# Altium project LAUNCHXL-F28069_B_1400922.PrjPcb
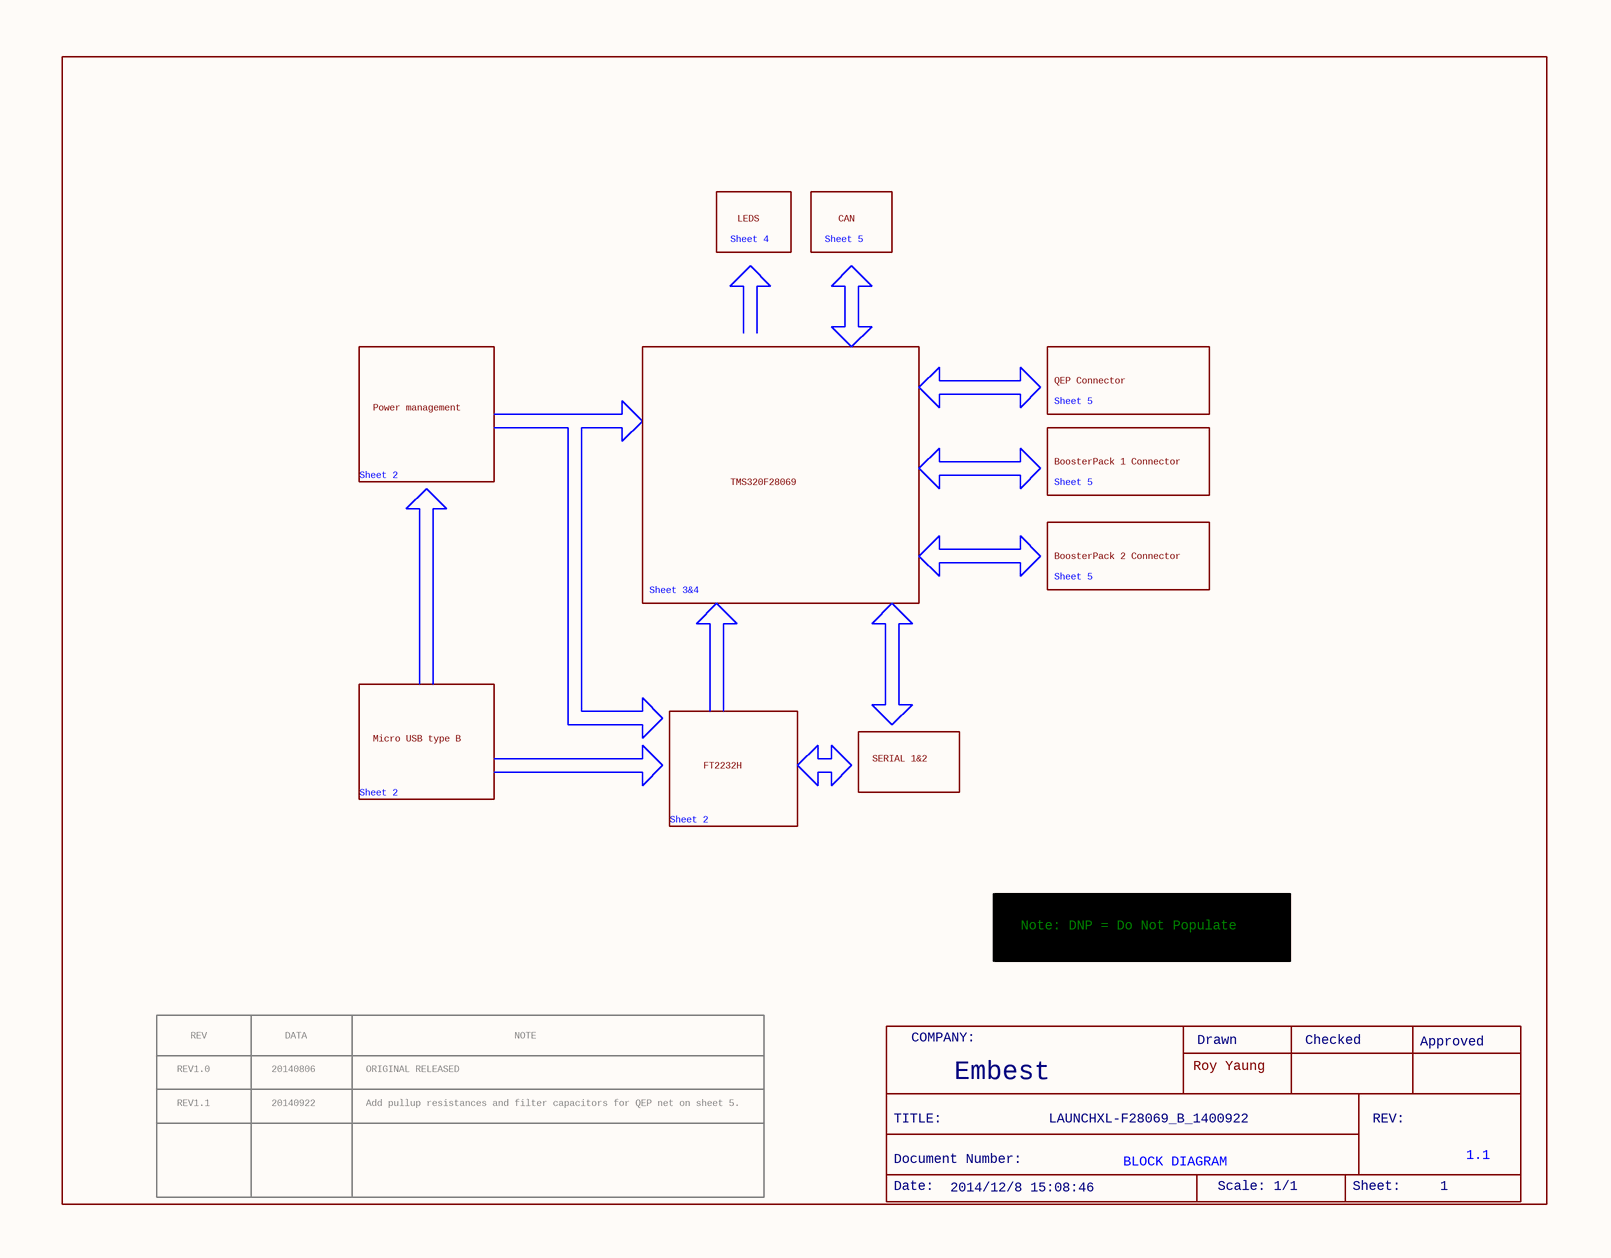
[diagram p0: LAUNCHXL-F28069_B_1400922_0.SchDoc]
7 sheets, 199 parts. Net scope: global (net labels, ports and power ports of the same name join across sheets).
Sheets:
  LAUNCHXL-F28069_B_1400922_0.SchDoc
  LAUNCHXL-F28069_B_1400922_1.SchDoc
  LAUNCHXL-F28069_B_1400922_2.SchDoc
  LAUNCHXL-F28069_B_1400922_3.SchDoc
  LAUNCHXL-F28069_B_1400922_4.SchDoc
  LAUNCHXL-F28069_B_1400922_5.SchDoc
  LAUNCHXL-F28069_B_1400922_6.SchDoc

## Sheet LAUNCHXL-F28069_B_1400922_0.SchDoc: LAUNCHXL-F28069_B_1400922
size 301 x 234 mm; Origin: Eagle; Date: 2014/12/8 15:08:46; SheetNumber: 1; GateName_1: G$1; SymbolName_1: FRAME_A_L; LibraryName: frames; DeviceSetName: FRAME_A_L; GateName_2: G$2; SymbolName_2: DOCFIELD; Sheet: Sheet:; REV: REV:; COMPANY: COMPANY:; Scale:1/1: Scale: 1/1; Drawn: Drawn; Checked: Checked; Approved: Approved; Embest: Embest

### Notes on the sheet
- Sheet 4
- LEDS
- Sheet 5
- CAN
- QEP Connector
- Power management
- BoosterPack 1 Connector
- Sheet 2
- TMS320F28069
- Sheet 3&4
- BoosterPack 2 Connector
- Micro USB type B
- FT2232H
- SERIAL 1&2
- Note: DNP = Do Not Populate
- REV1.0
- REV
- 20140806
- DATA
- ORIGINAL RELEASED
- NOTE
- COMPANY:
- Roy Yaung
- Drawn
- Checked
- Approved
- REV1.1
- 20140922
- Add pullup resistances and filter capacitors for QEP net on sheet 5.
- TITLE:
- Embest
- LAUNCHXL-F28069_B_1400922
- REV:
- Date:
- Document Number:
- 2014/12/8 15:08:46
- BLOCK DIAGRAM
- Scale: 1/1
- Sheet:
- 1
- 1.1

## Sheet LAUNCHXL-F28069_B_1400922_1.SchDoc: LAUNCHXL-F28069_B_1400922
size 302 x 238 mm; Origin: Eagle; Date: 2014/12/8 15:08:46; SheetNumber: 2; GateName_1: G$1; SymbolName_1: FRAME_A_L; LibraryName: frames; DeviceSetName: FRAME_A_L; GateName_2: G$2; SymbolName_2: DOCFIELD; Sheet: Sheet:; REV: REV:; COMPANY: COMPANY:; Scale:1/1: Scale: 1/1; Drawn: Drawn; Checked: Checked; Approved: Approved; Embest: Embest
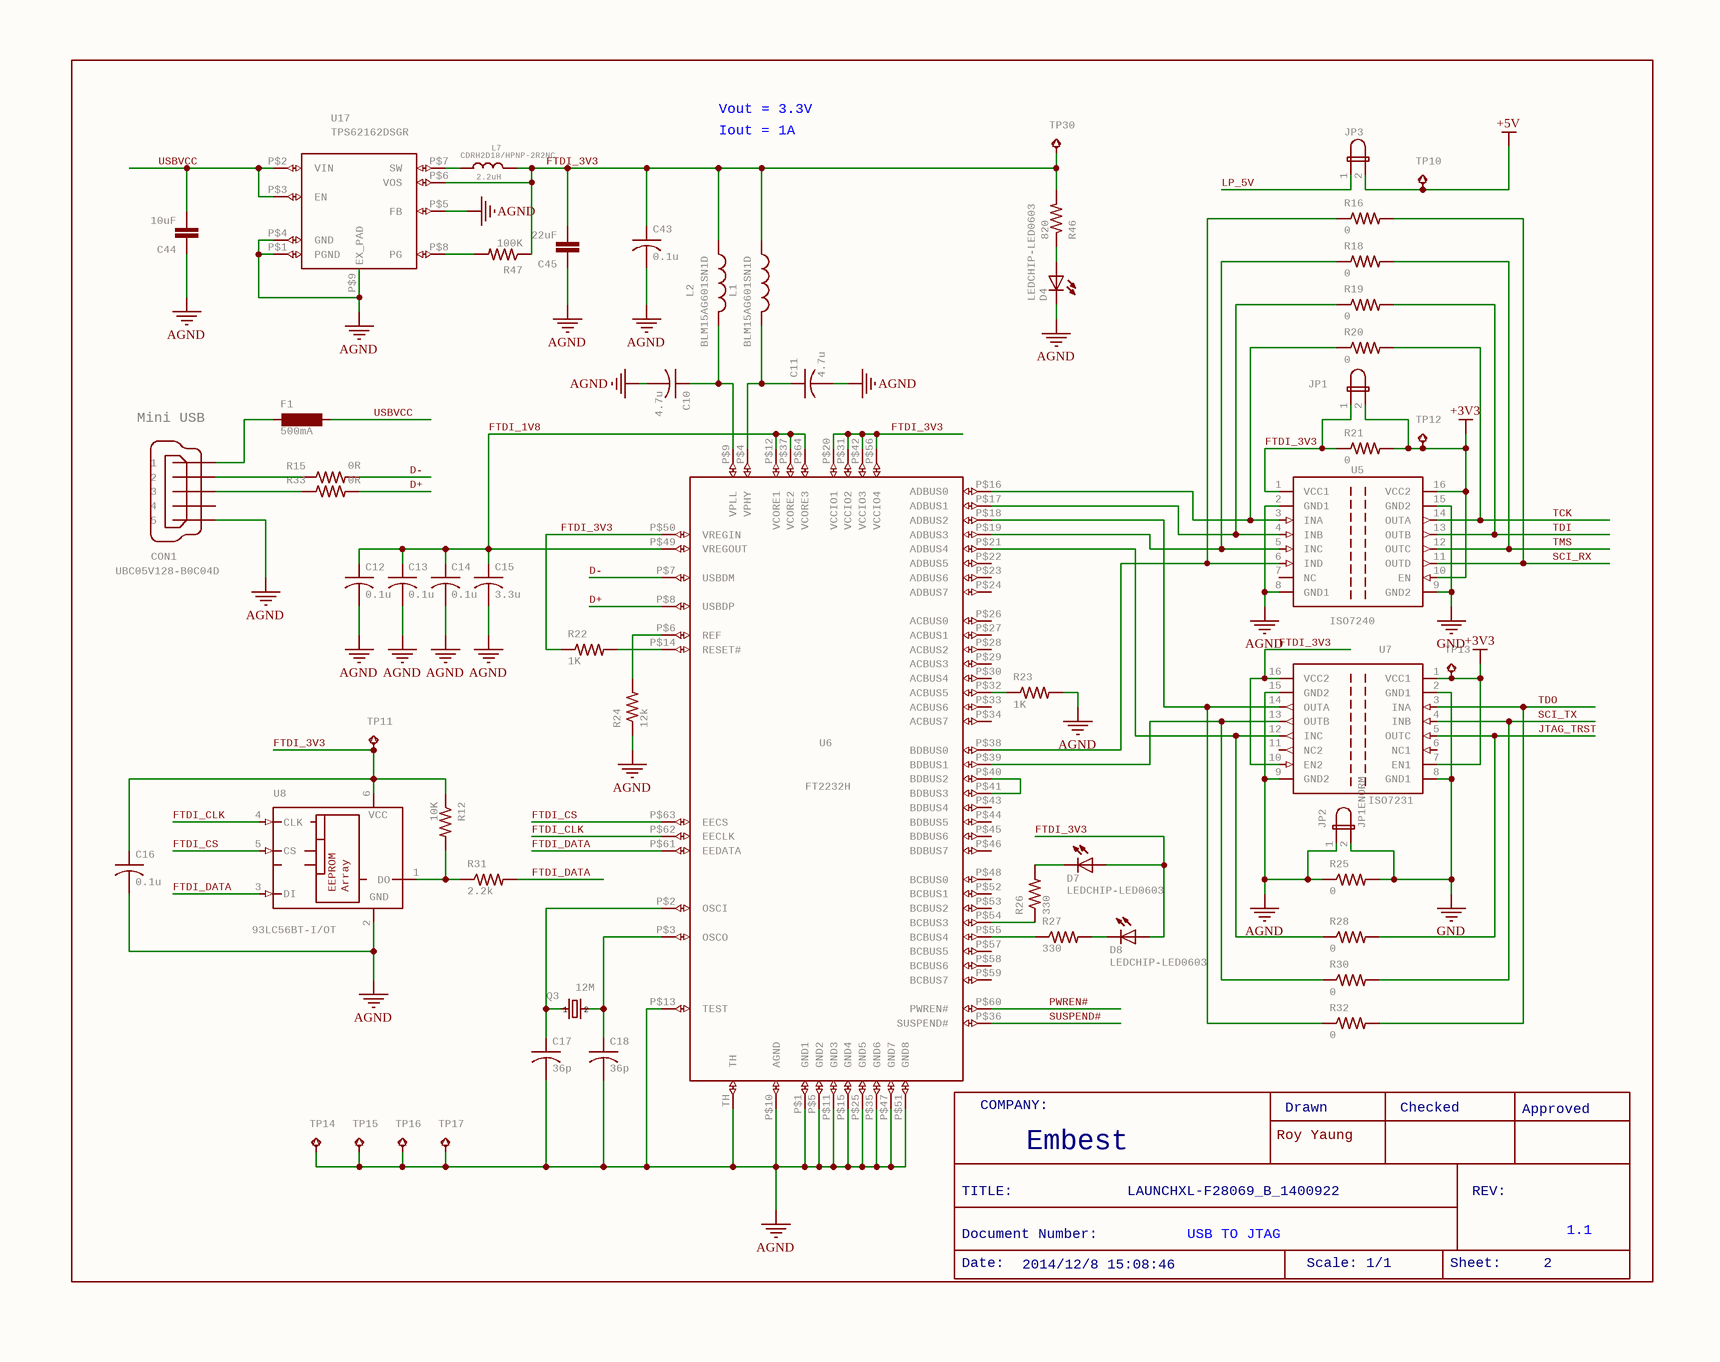
[diagram p1: LAUNCHXL-F28069_B_1400922_1.SchDoc]

### Parts
C10  4.7u  [C0402]
C11  4.7u  [C0402]
C12  0.1u  [C0402]
C13  0.1u  [C0402]
C14  0.1u  [C0402]
C15  3.3u  [C0402]
C16  0.1u  [C0402]
C17  36p  [C0402]
C18  36p  [C0402]
C43  0.1u  [C0402]
C44  10uF  [SPARKFUN_1210]
C45  22uF  [SPARKFUN_1210]
CON1  UBC05V128-B0C04D  [32005-201]
D4  LEDCHIP-LED0603  [CHIP-LED0603]
D7  LEDCHIP-LED0603  [CHIP-LED0603]
D8  LEDCHIP-LED0603  [CHIP-LED0603]
F1  500mA  [L1812]
JP1  JP1ENORM  [JP1]  (value not drawn)
JP2  JP1ENORM  [JP1]
JP3  JP1ENORM  [JP1]  (value not drawn)
L1  BLM15AG601SN1D  [R0402]
L2  BLM15AG601SN1D  [R0402]
L7  2.2uH  [INDUCT-3.2*3.2]
Q3  12M  [HC49UP]
R12  10K  [R0402]
R15  0R  [R0402]
R16  0  [R1206]
R18  0  [R1206]
R19  0  [R1206]
R20  0  [R1206]
R21  0  [R1206]
R22  1K  [R0402]
R23  1K  [R0402]
R24  12k  [R0402]
R25  0  [R1206]
R26  330  [R0402]
R27  330  [R0402]
R28  0  [R1206]
R30  0  [R1206]
R31  2.2k  [R0402]
R32  0  [R1206]
R33  0R  [R0402]
R46  820  [R0402]
R47  100K  [R0402]
TP10  TESTPAD_TPB1,27  [TESTPAD_B1,27]  (value not drawn)
TP11  TESTPAD_TPB1,27  [TESTPAD_B1,27]  (value not drawn)
TP12  TESTPAD_TPB1,27  [TESTPAD_B1,27]  (value not drawn)
TP13  TESTPAD_TPB1,27  [TESTPAD_B1,27]  (value not drawn)
TP14  TESTPAD_TPB1,27  [TESTPAD_B1,27]  (value not drawn)
TP15  TESTPAD_TPB1,27  [TESTPAD_B1,27]  (value not drawn)
TP16  TESTPAD_TPB1,27  [TESTPAD_B1,27]  (value not drawn)
TP17  TESTPAD_TPB1,27  [TESTPAD_B1,27]  (value not drawn)
TP30  TESTPAD_TPB1,27  [TESTPAD_B1,27]  (value not drawn)
U5  ISO7240  [SO-16DW]
U6  FT2232H  [QFN64]
U7  ISO7231  [SO-16DW]
U8  93LC56BT-I/OT  [SOT23-6]
U17  TPS62162DSGR  [TI_DSG8]
U$9  ROY_JUMPER  [ROY_JUMPER]  (value not drawn)
U$10  ROY_JUMPER  [ROY_JUMPER]  (value not drawn)
U$11  ROY_JUMPER  [ROY_JUMPER]  (value not drawn)

### Nets
+3V3: JP1.2 R21.2 TP12.TP TP13.TP U5.10(EN) U5.16(VCC2) U7.1(VCC1) U7.7(EN1)
+5V: JP3.2 TP10.TP  [project net EQEP1A]
AGND: C10.2 C11.2 C12.2 C13.2 C14.2 C15.2 C16.2 C17.2 C18.2 C43.2 C44.1 C45.1 CON1.5 D4.C JP2.1 R23.2 R24.1 R25.1 TP14.TP TP15.TP TP16.TP TP17.TP U5.2(GND1) U5.8(GND1) U6.P$1(GND1) U6.P$5(GND2) U6.P$10(AGND) U6.P$11(GND3) U6.P$13(TEST) U6.P$15(GND4) U6.P$25(GND5) U6.P$35(GND6) U6.P$47(GND7) U6.P$51(GND8) U6.TH U7.9(GND2) U7.15(GND2) U8.2(GND) U17.P$1(PGND) U17.P$4(GND) U17.P$5(FB) U17.P$9(EX_PAD)
GND: JP2.2 R25.2 U5.9(GND2) U5.15(GND2) U7.2(GND1) U7.8(GND1)
D+: R33.2 U6.P$8(USBDP)
D-: R15.2 U6.P$7(USBDM)
FTDI_1V8: C12.1 C13.1 C14.1 C15.1 U6.P$12(VCORE1) U6.P$37(VCORE2) U6.P$49(VREGOUT) U6.P$64(VCORE3)
FTDI_3V3: C16.1 C43.1 C45.2 D7.A D8.A JP1.1 L1.1 L2.1 L7.P$1 R12.1 R21.1 R22.1 R46.2 R47.1 TP11.TP TP30.TP U5.1(VCC1) U6.P$20(VCCIO1) U6.P$31(VCCIO2) U6.P$42(VCCIO3) U6.P$50(VREGIN) U6.P$56(VCCIO4) U7.10(EN2) U7.16(VCC2) U8.6(VCC) U17.P$6(VOS)
FTDI_CLK: U6.P$62(EECLK) U8.4(CLK)
FTDI_CS: U6.P$63(EECS) U8.5(CS)
FTDI_DATA: R31.2 U6.P$61(EEDATA) U8.3(DI)
JTAG_TRST: R28.2 U7.5(OUTC)
LP_5V: JP3.1
PWREN#: U6.P$60(PWREN#)
SCI_RX: R16.2 U5.11(OUTD)
SCI_TX: R30.2 U7.4(INB)
SUSPEND#: U6.P$36(SUSPEND#)
TCK: R20.2 U5.14(OUTA)
TDI: R19.2 U5.13(OUTB)
TDO: R32.2 U7.3(INA)
TMS: R18.2 U5.12(OUTC)
USBVCC: C44.2 F1.1 U17.P$2(VIN) U17.P$3(EN)
NetC10_1: C10.1 L2.2 U6.P$9(VPLL)
NetC11_1: C11.1 L1.2 U6.P$4(VPHY)
NetC17_1: C17.1 Q3.1 U6.P$2(OSCI)
NetC18_1: C18.1 Q3.2 U6.P$3(OSCO)
NetCON1_1: CON1.1 F1.2
NetCON1_2: CON1.2 R15.1
NetCON1_3: CON1.3 R33.1
NetD4_A: D4.A R46.1
NetD7_C: D7.C R26.2
NetD8_C: D8.C R27.2
NetL7_P$2: L7.P$2 U17.P$7(SW)
NetR12_2: R12.2 R31.1 U8.1(DO)
NetR16_1: R16.1 U5.6(IND) U6.P$38(BDBUS0)
NetR18_1: R18.1 U5.5(INC) U6.P$19(ADBUS3)
NetR19_1: R19.1 U5.4(INB) U6.P$17(ADBUS1)
NetR20_1: R20.1 U5.3(INA) U6.P$16(ADBUS0)
NetR22_2: R22.2 U6.P$14(RESET#)
NetR23_1: R23.1 U6.P$32(ACBUS5)
NetR24_2: R24.2 U6.P$6(REF)
NetR26_1: R26.1 U6.P$54(BCBUS3)
NetR27_1: R27.1 U6.P$55(BCBUS4)
NetR28_1: R28.1 U6.P$21(ADBUS4) U7.12(INC)
NetR30_1: R30.1 U6.P$39(BDBUS1) U7.13(OUTB)
NetR32_1: R32.1 U6.P$18(ADBUS2) U7.14(OUTA)
NetR47_2: R47.2 U17.P$8(PG)
NetU6_P$40: U6.P$40(BDBUS2) U6.P$41(BDBUS3)

Not connected (* = marked no-connect by the designer): CON1 4; U5 7(NC); U6 P$22(ADBUS5) P$23(ADBUS6) P$24(ADBUS7) P$26(ACBUS0) P$27(ACBUS1) P$28(ACBUS2) P$29(ACBUS3) P$30(ACBUS4) P$33(ACBUS6) P$34(ACBUS7) P$43(BDBUS4) P$44(BDBUS5) P$45(BDBUS6) P$46(BDBUS7) P$48(BCBUS0) P$52(BCBUS1) P$53(BCBUS2) P$57(BCBUS5) P$58(BCBUS6) P$59(BCBUS7); U7 6(NC1) 11(NC2)

### Notes on the sheet
- (near L7) CDRH2D18/HPNP-2R2NC
- Vout = 3.3V
- Iout = 1A
- (near CON1) Mini USB
- (near U6) COMPANY:
- Embest
- Roy Yaung
- Drawn
- Checked
- Approved
- TITLE:
- Document Number:
- LAUNCHXL-F28069_B_1400922
- USB TO JTAG
- REV:
- 1.1
- Date:
- 2014/12/8 15:08:46
- Scale: 1/1
- Sheet:
- 2

### Library data of the parts
C10-C18 C43 = C-USC0402: CAPACITOR, American symbol; GateName_1: G$1; SymbolName_1: C-US; DeviceName: C0402; LibraryName: rcl; DeviceSetName: C-US
C44 C45 = SPARKFUN_CAP1210: CapacitorStandard 0603 ceramic capacitor, and 0.1" leaded capacitor.; GateName_1: G$1; DeviceName: 1210; SymbolName_1: SPARKFUN_CAP; LibraryName: RF430FRL152H_EVM_a; DeviceSetName: SPARKFUN_CAP
CON1 = MINI-USB-32005-201: MINI USB-B Conector   Source: www.cypressindustries.com; GateName_1: G$1; SymbolName_1: MINI-USB-5; DeviceName: 32005-201; LibraryName: con-cypressindustries; DeviceSetName: MINI-USB-; MF: MF; MPN: MPN; OC_FARNELL: unknown; OC_NEWARK: unknown
D4 D7 D8 = LEDCHIP-LED0603: LED   OSRAM: - CHIPLED LG R971, LG N971, LY N971, LG Q971, LY Q971, LO R971, LY R971 LH N974, LH R974 LS Q976, LO Q976, LY Q976 LO Q996 - Hyper CHIPLED LW Q18S LB Q993, LB Q99A, LB R99A - SideLED LS A670, LO A670, LY A670, LG A670, LP A670 LB A673, LV A673, LT A673, LW A673 LH A674 LY A675 LS A676, LA A676, LO A676, LY A676, LW A676 LS A679, LY A679, LG A679 -  Hyper Micro SIDELED庐 LS Y876, LA Y876, LO Y876, LY Y876 LT Y87S - SmartLED LW L88C, LW L88S LB L89C, LB L89S, LG L890 LS L89K, LO L89K, LY L89K LS L896, LA L896, LO L896, LY L896 - TOPLED LS T670, LO T670, LY T670, LG T670, LP T670 LSG T670, LSP T670, LSY T670, LOP T670, LYG T670 LG T671, LOG T671, LSG T671 LB T673, LV T673, LT T673, LW T673 LH T674 LS T676, LA T676, LO T676, LY T676, LB T676, LH T676, LSB T676, LW T676 LB T67C, LV T67C, LT T67C, LS T67K, LO T67K, LY T67K, LW E67C LS E67B, LA E67B, LO E67B, LY E67B, LB E67C, LV E67C, LT E67C LW T67C LS T679, LY T679, LG T679 LS T770, LO T770, LY T770, LG T770, LP T770 LB T773, LV T773, LT T773, LW T773 LH T774 LS E675, LA E675, LY E675, LS T675 LS T776, LA T776, LO T776, LY T776, LB T776 LHGB T686 LT T68C, LB T68C - Hyper Mini TOPLED庐 LB M676 - Mini TOPLED Santana庐 LG M470 LS M47K, LO M47K, LY M47K    Source: http://www.osram.convergy.de   LUXEON: - LUMILED庐 LXK2-PW12-R00, LXK2-PW12-S00, LXK2-PW14-U00, LXK2-PW14-V00 LXK2-PM12-R00, LXK2-PM12-S00, LXK2-PM14-U00 LXK2-PE12-Q00, LXK2-PE12-R00, LXK2-PE12-S00, LXK2-PE14-T00, LXK2-PE14-U00 LXK2-PB12-K00, LXK2-PB12-L00, LXK2-PB12-M00, LXK2-PB14-N00, LXK2-PB14-P00, LXK2-PB14-Q00 LXK2-PR12-L00, LXK2-PR12-M00, LXK2-PR14-Q00, LXK2-PR14-R00 LXK2-PD12-Q00, LXK2-PD12-R00, LXK2-PD12-S00 LXK2-PH12-R00, LXK2-PH12-S00 LXK2-PL12-P00, LXK2-PL12-Q00, LXK2-PL12-R00    Source: www.luxeon.com   KINGBRIGHT:   KA-3528ASYC Source: www.kingbright.com; GateName_1: G$1; SymbolName_1: LED; DeviceName: CHIP-LED0603; LibraryName: led; DeviceSetName: LED
F1 = L-EUL1812: INDUCTOR, European symbol; GateName_1: G$1; SymbolName_1: L-EU; DeviceName: L1812; LibraryName: rcl; DeviceSetName: L-EU
JP1-JP3 = JP1ENORM: JUMPER; GateName_1: A; SymbolName_1: JP2E; DeviceName: NORM; DeviceSetName: JP1E; LibraryName: jumper
L1 L2 = L-US0402: INDUCTOR, American symbol; GateName_1: G$1; SymbolName_1: L-US; DeviceName: 0402; LibraryName: rcl; DeviceSetName: L-US
L7 = VLF4012A`: GateName_1: 1; SymbolName_1: INDUCTOR; DeviceName: `; LibraryName: LAUNCHXL-F28027; DeviceSetName: VLF4012A
Q3 = CRYSTALHC49UP: CRYSTAL; GateName_1: G$1; SymbolName_1: Q; DeviceName: HC49UP; LibraryName: crystal; DeviceSetName: CRYSTAL; 1: 1; 2: 2; MF: MF; MPN: MPN; OC_FARNELL: unknown; OC_NEWARK: unknown
R12 R15 R22-R24 R26 R27 R31 R33 R46 R47 = R-US_R0402: RESISTOR, American symbol; GateName_1: G$1; SymbolName_1: R-US; DeviceSetName: R-US_; DeviceName: R0402; LibraryName: rcl
R16 R18-R21 R25 R28 R30 R32 = R-US_R1206: RESISTOR, American symbol; GateName_1: G$1; SymbolName_1: R-US; DeviceSetName: R-US_; DeviceName: R1206; LibraryName: rcl
TP10-TP17 TP30 = TESTPAD_TPB1,27: Test pad; GateName_1: G$1; DeviceName: B1,27; SymbolName_1: TESTPAD_TP; LibraryName: RF430FRL152H_EVM_a; DeviceSetName: TESTPAD_TP
U5 = ISO7240: HIGH SPEED QUAD DIGITAL ISOLATORS   Source: http://focus.ti.com/lit/ds/symlink/iso7240m.pdf; MPN: ISO7240MDW; GateName_1: G$1; SymbolName_1: ISO7240; LibraryName: texas; DeviceSetName: ISO7240; MF: MF; OC_FARNELL: 1755124; OC_NEWARK: 58M0385
U6 = FT2232H: GateName_1: G$1; SymbolName_1: FT2232H; LibraryName: ti_trey; DeviceSetName: FT2232H
U7 = ISO7231: GateName_1: G$1; SymbolName_1: ISO7231; LibraryName: texas; DeviceSetName: ISO7231
U8 = 93*: Serial EPROM   1 K/2 K/4 K, low voltage, Microwire; GateName_1: G$1; SymbolName_1: 93LC46; LibraryName: ti_trey; DeviceSetName: 93*; Array: Array; VCC: VCC; GND: GND; EEPROM: EEPROM
U17 = TPS62162DSGR: GateName_1: G$1; SymbolName_1: TPS62162; LibraryName: LAUNCHXL-F28027; DeviceSetName: TPS62162DSGR
U$9-U$11 = ROY_JUMPER: GateName_1: G$1; SymbolName_1: ROY_JUMPER; LibraryName: roy; DeviceSetName: ROY_JUMPER

## Sheet LAUNCHXL-F28069_B_1400922_2.SchDoc: LAUNCHXL-F28069_B_1400922
size 301 x 234 mm; Origin: Eagle; Date: 2014/12/8 15:08:46; SheetNumber: 3; GateName_1: G$1; SymbolName_1: FRAME_A_L; LibraryName: frames; DeviceSetName: FRAME_A_L; GateName_2: G$2; SymbolName_2: DOCFIELD; Sheet: Sheet:; REV: REV:; COMPANY: COMPANY:; Scale:1/1: Scale: 1/1; Drawn: Drawn; Checked: Checked; Approved: Approved; Embest: Embest
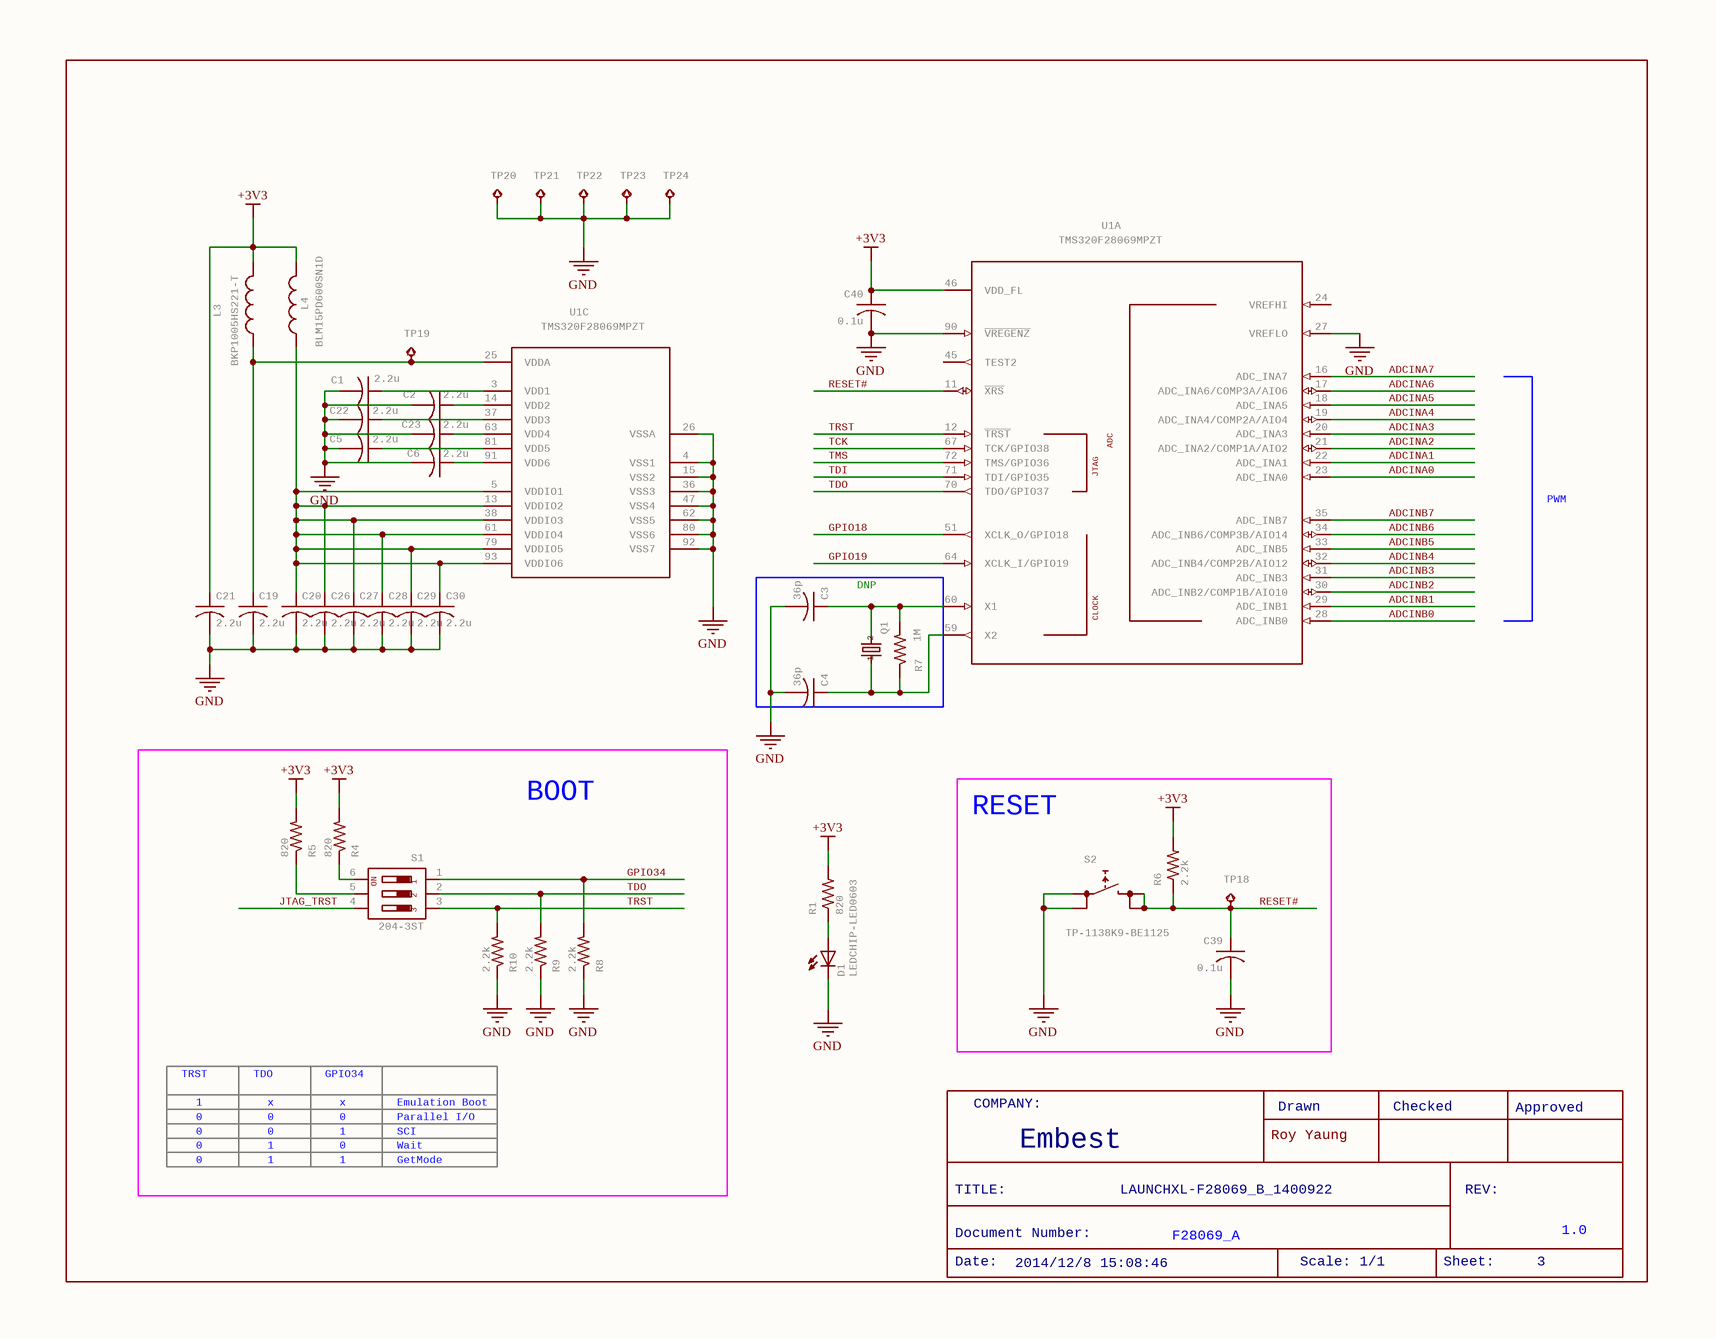
[diagram p2: LAUNCHXL-F28069_B_1400922_2.SchDoc]

### Parts
C1  2.2u  [C0402]
C2  2.2u  [C0402]
C3  36p  [C0402]
C4  36p  [C0402]
C5  2.2u  [C0402]
C6  2.2u  [C0402]
C19  2.2u  [C0402]
C20  2.2u  [C0402]
C21  2.2u  [C0402]
C22  2.2u  [C0402]
C23  2.2u  [C0402]
C26  2.2u  [C0402]
C27  2.2u  [C0402]
C28  2.2u  [C0402]
C29  2.2u  [C0402]
C30  2.2u  [C0402]
C39  0.1u  [C0402]
C40  0.1u  [C0402]
D1  LEDCHIP-LED0603  [CHIP-LED0603]
L3  BKP1005HS221-T  [R0402]
L4  BLM15PD600SN1D  [R0402]
Q1  CRYSTALHC49S  [HC49/S]  (value not drawn)
R1  820  [R0402]
R4  820  [R0402]
R5  820  [R0402]
R6  2.2k  [R0402]
R7  1M  [R0402]
R8  2.2k  [R0402]
R9  2.2k  [R0402]
R10  2.2k  [R0402]
S1  204-3ST  [CTS-219-03]
S2  TP-1138K9-BE1125  [FSMJSMA]
TP18  TESTPAD_TPB1,27  [TESTPAD_B1,27]  (value not drawn)
TP19  TESTPAD_TPB1,27  [TESTPAD_B1,27]  (value not drawn)
TP20  TESTPAD_TPB1,27  [TESTPAD_B1,27]  (value not drawn)
TP21  TESTPAD_TPB1,27  [TESTPAD_B1,27]  (value not drawn)
TP22  TESTPAD_TPB1,27  [TESTPAD_B1,27]  (value not drawn)
TP23  TESTPAD_TPB1,27  [TESTPAD_B1,27]  (value not drawn)
TP24  TESTPAD_TPB1,27  [TESTPAD_B1,27]  (value not drawn)
U1  TMS320F28069MPZT  [PQFP100]  (parts A,C of 3)

### Blocks framed on the sheet
DNP: C3 C4 Q1 R7
BOOT: R4 R5 R8-R10 S1
RESET: C39 R6 S2 TP18

### Nets
+3V3: C21.1 C40.1 L3.2 L4.2 R1.2 R4.2 R5.2 R6.2 U1.46(VDD_FL)
GND: C1.2 C2.2 C3.2 C4.2 C5.2 C6.2 C19.2 C20.2 C21.2 C22.2 C23.2 C26.2 C27.2 C28.2 C29.2 C30.2 C39.2 C40.2 D1.C R8.1 R9.1 R10.1 S2.P$1 S2.P$2 TP20.TP TP21.TP TP22.TP TP23.TP TP24.TP U1.4(VSS1) U1.15(VSS2) U1.26(VSSA) U1.27(VREFLO) U1.36(VSS3) U1.47(VSS4) U1.62(VSS5) U1.80(VSS6) U1.90(~{VREGENZ}) U1.92(VSS7)
ADCINA0: U1.23(ADC_INA0)
ADCINA1: U1.22(ADC_INA1)
ADCINA2: U1.21(ADC_INA2/COMP1A/AIO2)
ADCINA3: U1.20(ADC_INA3)
ADCINA4: U1.19(ADC_INA4/COMP2A/AIO4)
ADCINA5: U1.18(ADC_INA5)
ADCINA6: U1.17(ADC_INA6/COMP3A/AIO6)
ADCINA7: U1.16(ADC_INA7)
ADCINB0: U1.28(ADC_INB0)
ADCINB1: U1.29(ADC_INB1)
ADCINB2: U1.30(ADC_INB2/COMP1B/AIO10)
ADCINB3: U1.31(ADC_INB3)
ADCINB4: U1.32(ADC_INB4/COMP2B/AIO12)
ADCINB5: U1.33(ADC_INB5)
ADCINB6: U1.34(ADC_INB6/COMP3B/AIO14)
ADCINB7: U1.35(ADC_INB7)
GPIO18: U1.51(XCLK_O/GPIO18)
GPIO19: U1.64(XCLK_I/GPIO19)
GPIO34: R8.2 S1.1
JTAG_TRST: S1.4
RESET#: C39.1 R6.1 S2.P$3 S2.P$4 TP18.TP U1.11(~{XRS})
TCK: U1.67(TCK/GPIO38)
TDI: U1.71(TDI/GPIO35)
TDO: R9.2 S1.2 U1.70(TDO/GPIO37)
TMS: U1.72(TMS/GPIO36)
TRST: R10.2 S1.3 U1.12(~{TRST})
NetC1_1: C1.1 U1.3(VDD1)
NetC2_1: C2.1 U1.14(VDD2)
NetC3_1: C3.1 Q1.2 R7.2 U1.60(X1)
NetC4_1: C4.1 Q1.1 R7.1 U1.59(X2)
NetC5_1: C5.1 U1.81(VDD5)
NetC6_1: C6.1 U1.91(VDD6)
NetC19_1: C19.1 L3.1 TP19.TP U1.25(VDDA)
NetC20_1: C20.1 C26.1 C27.1 C28.1 C29.1 C30.1 L4.1 U1.5(VDDIO1) U1.13(VDDIO2) U1.38(VDDIO3) U1.61(VDDIO4) U1.79(VDDIO5) U1.93(VDDIO6)
NetC22_1: C22.1 U1.37(VDD3)
NetC23_1: C23.1 U1.63(VDD4)
NetD1_A: D1.A R1.1
NetR4_1: R4.1 S1.6
NetR5_1: R5.1 S1.5

Not connected (* = marked no-connect by the designer): U1 24(VREFHI) 45(TEST2)

### Notes on the sheet
- PWM
- TRST
- TDO
- GPIO34
- 1
- 0
- x
- Emulation Boot
- Parallel I/O
- SCI
- Wait
- COMPANY:
- Roy Yaung
- Drawn
- Checked
- Approved
- GetMode
- TITLE:
- Embest
- LAUNCHXL-F28069_B_1400922
- REV:
- Date:
- Document Number:
- 2014/12/8 15:08:46
- F28069_A
- Scale: 1/1
- Sheet:
- 3
- 1.0

### Library data of the parts
C1-C6 C19-C23 C26-C30 C39 C40 = C-USC0402: as C10 on sheet LAUNCHXL-F28069_B_1400922_1; DeviceName: C0402; LibraryName: rcl; DeviceSetName: C-US
D1 = LEDCHIP-LED0603: as D4 on sheet LAUNCHXL-F28069_B_1400922_1; SymbolName_1: LED; DeviceName: CHIP-LED0603; LibraryName: led; DeviceSetName: LED
L3 L4 = L-US0402: as L1 on sheet LAUNCHXL-F28069_B_1400922_1; LibraryName: rcl; DeviceSetName: L-US
Q1 = CRYSTALHC49S: CRYSTAL; GateName_1: G$1; SymbolName_1: Q; DeviceName: HC49S; LibraryName: crystal; DeviceSetName: CRYSTAL; 1: 1; 2: 2; MF: MF; MPN: MPN; OC_FARNELL: 1667008; OC_NEWARK: unknown
R1 R4-R10 = R-US_R0402: as R12 on sheet LAUNCHXL-F28069_B_1400922_1; DeviceName: R0402; LibraryName: rcl
S1 = 219-03*: Surface Mount DIP Switch Series 219 SMT   CTS Electronic Components Sourc: www.ctscorp.com; GateName_1: G$1; SymbolName_1: DIP03; LibraryName: switch-dil; DeviceSetName: 219-03*; 1: 1; 2: 2; 3: 3; ON: ON; MF: MF; MPN: MPN; OC_FARNELL: unknown; OC_NEWARK: unknown
S2 = FSMJSMA: GateName_1: G$1; SymbolName_1: NORMOPEN; LibraryName: switch; DeviceSetName: FSMJSMA
TP18-TP24 = TESTPAD_TPB1,27: as TP10 on sheet LAUNCHXL-F28069_B_1400922_1; SymbolName_1: TESTPAD_TP; LibraryName: RF430FRL152H_EVM_a; DeviceSetName: TESTPAD_TP
U1 = TMS320F28069PZSR: GateName_1: G$1; SymbolName_1: TI_TMSF2806X_FUN; GateName_2: G$2; SymbolName_2: TI_TMSF2806X_IO; GateName_3: G$3; SymbolName_3: TI_TMSF2806X_PW; DeviceName: R; LibraryName: LAUNCHXL-F28027; DeviceSetName: TMS320F28069PZS; JTAG: JTAG; CLOCK: CLOCK; ADC: ADC

## Sheet LAUNCHXL-F28069_B_1400922_3.SchDoc: LAUNCHXL-F28069_B_1400922
size 301 x 234 mm; Origin: Eagle; Date: 2014/12/8 15:08:46; SheetNumber: 4; GateName_1: G$1; SymbolName_1: FRAME_A_L; LibraryName: frames; DeviceSetName: FRAME_A_L; GateName_2: G$2; SymbolName_2: DOCFIELD; Sheet: Sheet:; REV: REV:; COMPANY: COMPANY:; Scale:1/1: Scale: 1/1; Drawn: Drawn; Checked: Checked; Approved: Approved; Embest: Embest
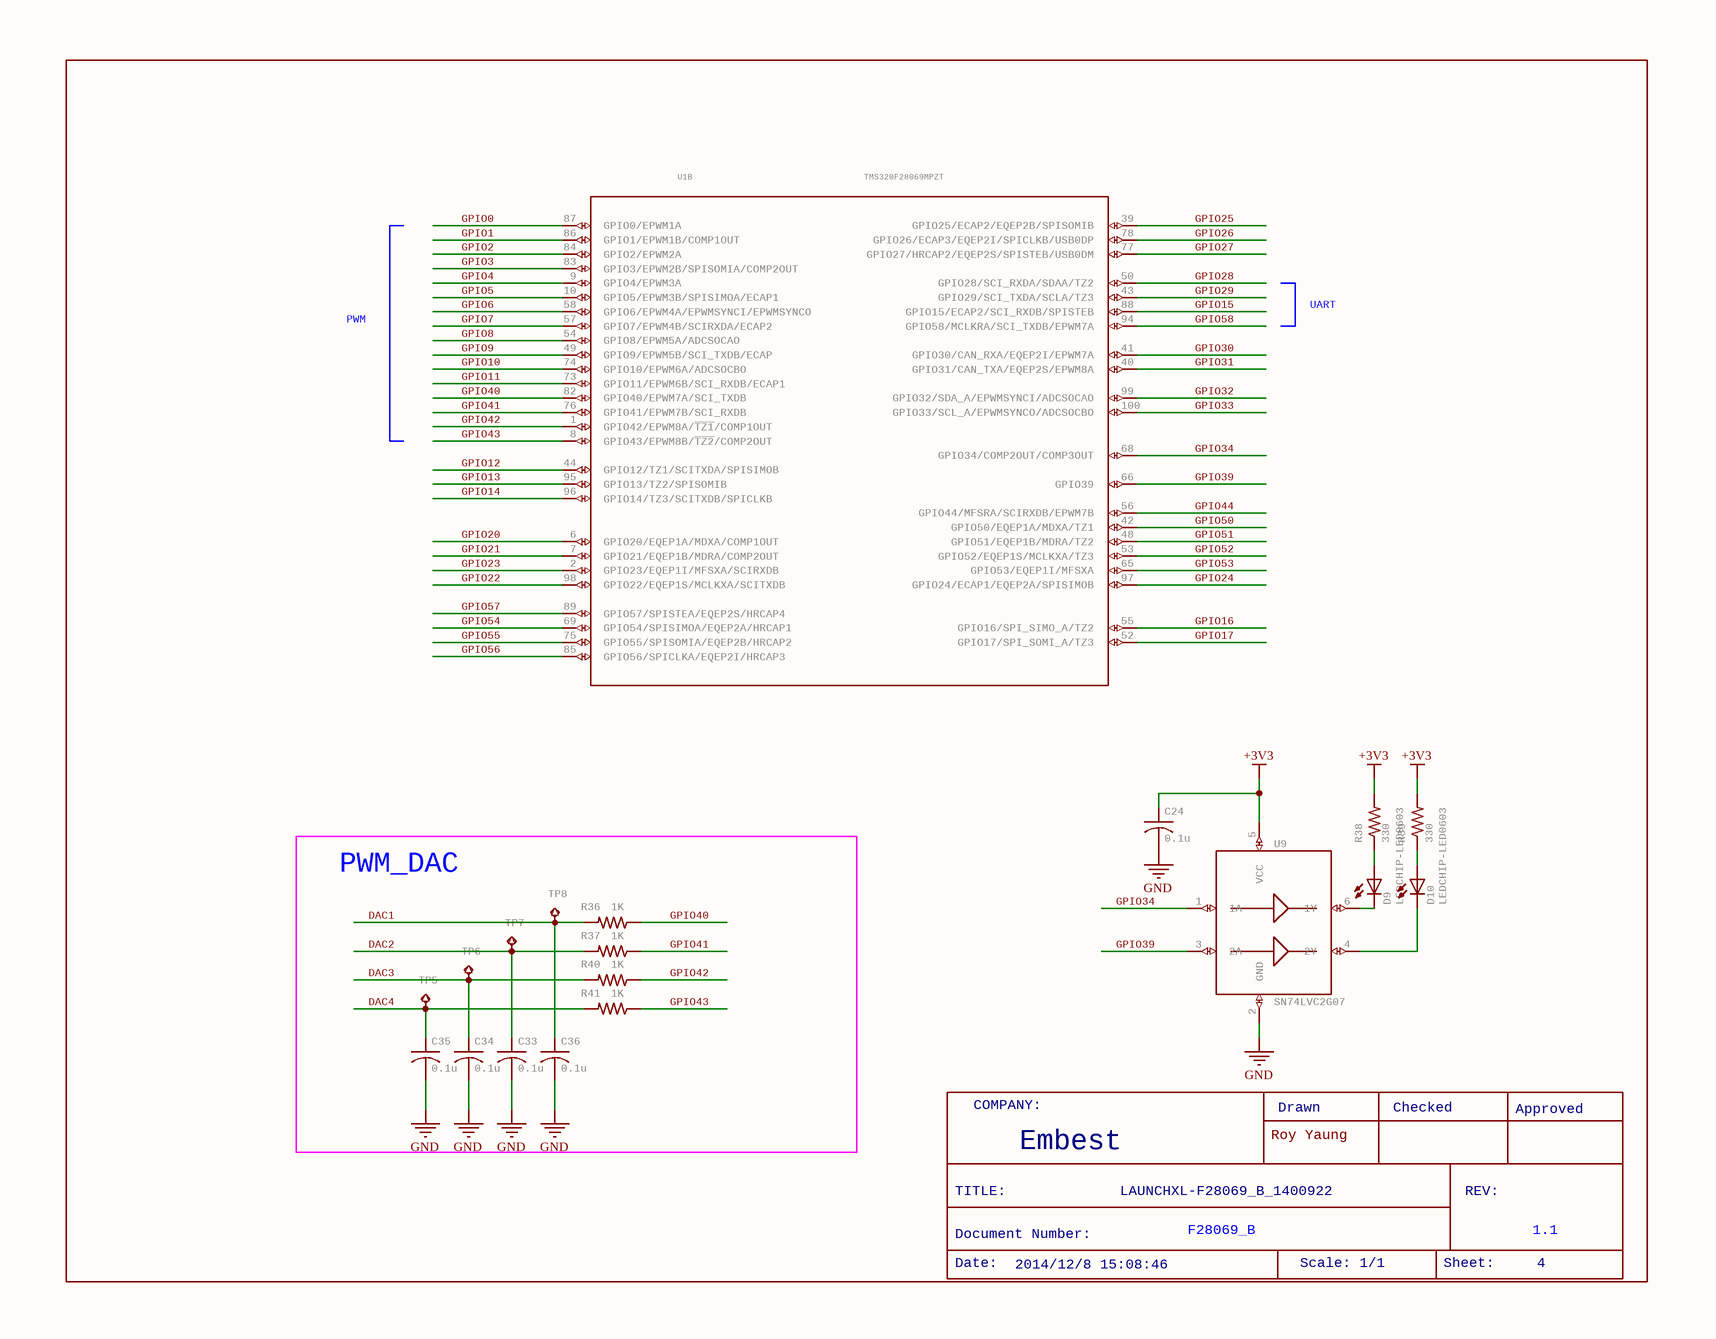
[diagram p3: LAUNCHXL-F28069_B_1400922_3.SchDoc]

### Parts
C24  0.1u  [C0402]
C33  0.1u  [C0402]
C34  0.1u  [C0402]
C35  0.1u  [C0402]
C36  0.1u  [C0402]
D9  LEDCHIP-LED0603  [CHIP-LED0603]
D10  LEDCHIP-LED0603  [CHIP-LED0603]
R36  1K  [R0402]
R37  1K  [R0402]
R38  330  [R0402]
R39  330  [R0402]
R40  1K  [R0402]
R41  1K  [R0402]
TP5  TESTPAD_TPB1,27  [TESTPAD_B1,27]  (value not drawn)
TP6  TESTPAD_TPB1,27  [TESTPAD_B1,27]  (value not drawn)
TP7  TESTPAD_TPB1,27  [TESTPAD_B1,27]  (value not drawn)
TP8  TESTPAD_TPB1,27  [TESTPAD_B1,27]  (value not drawn)
U1  TMS320F28069MPZT  [PQFP100]  (part B of 3)
U9  SN74LVC2G07  [SOT23-6-DBV]

### Blocks framed on the sheet
PWM_DAC: C33-C36 R36 R37 R40 R41 TP5-TP8

### Nets
+3V3: C24.1 R38.2 R39.2 U9.5(VCC)
GND: C24.2 C33.2 C34.2 C35.2 C36.2 U9.2(GND)
DAC1: C36.1 R36.2 TP8.TP
DAC2: C33.1 R37.2 TP7.TP
DAC3: C34.1 R40.2 TP6.TP
DAC4: C35.1 R41.2 TP5.TP
GPIO0: U1.87(GPIO0/EPWM1A)
GPIO1: U1.86(GPIO1/EPWM1B/COMP1OUT)
GPIO2: U1.84(GPIO2/EPWM2A)
GPIO3: U1.83(GPIO3/EPWM2B/SPISOMIA/COMP2OUT)
GPIO4: U1.9(GPIO4/EPWM3A)
GPIO5: U1.10(GPIO5/EPWM3B/SPISIMOA/ECAP1)
GPIO6: U1.58(GPIO6/EPWM4A/EPWMSYNCI/EPWMSYNCO)
GPIO7: U1.57(GPIO7/EPWM4B/SCIRXDA/ECAP2)
GPIO8: U1.54(GPIO8/EPWM5A/ADCSOCAO)
GPIO9: U1.49(GPIO9/EPWM5B/SCI_TXDB/ECAP)
GPIO10: U1.74(GPIO10/EPWM6A/ADCSOCBO)
GPIO11: U1.73(GPIO11/EPWM6B/SCI_RXDB/ECAP1)
GPIO12: U1.44(GPIO12/TZ1/SCITXDA/SPISIMOB)
GPIO13: U1.95(GPIO13/TZ2/SPISOMIB)
GPIO14: U1.96(GPIO14/TZ3/SCITXDB/SPICLKB)
GPIO15: U1.88(GPIO15/ECAP2/SCI_RXDB/SPISTEB)
GPIO16: U1.55(GPIO16/SPI_SIMO_A/TZ2)
GPIO17: U1.52(GPIO17/SPI_SOMI_A/TZ3)
GPIO20: U1.6(GPIO20/EQEP1A/MDXA/COMP1OUT)
GPIO21: U1.7(GPIO21/EQEP1B/MDRA/COMP2OUT)
GPIO22: U1.98(GPIO22/EQEP1S/MCLKXA/SCITXDB)
GPIO23: U1.2(GPIO23/EQEP1I/MFSXA/SCIRXDB)
GPIO24: U1.97(GPIO24/ECAP1/EQEP2A/SPISIMOB)
GPIO25: U1.39(GPIO25/ECAP2/EQEP2B/SPISOMIB)
GPIO26: U1.78(GPIO26/ECAP3/EQEP2I/SPICLKB/USB0DP)
GPIO27: U1.77(GPIO27/HRCAP2/EQEP2S/SPISTEB/USB0DM)
GPIO28: U1.50(GPIO28/SCI_RXDA/SDAA/TZ2)
GPIO29: U1.43(GPIO29/SCI_TXDA/SCLA/TZ3)
GPIO30: U1.41(GPIO30/CAN_RXA/EQEP2I/EPWM7A)
GPIO31: U1.40(GPIO31/CAN_TXA/EQEP2S/EPWM8A)
GPIO32: U1.99(GPIO32/SDA_A/EPWMSYNCI/ADCSOCAO)
GPIO33: U1.100(GPIO33/SCL_A/EPWMSYNCO/ADCSOCBO)
GPIO34: U1.68(GPIO34/COMP2OUT/COMP3OUT) U9.1(1A)
GPIO39: U1.66(GPIO39) U9.3(2A)
GPIO40: R36.1 U1.82(GPIO40/EPWM7A/SCI_TXDB)
GPIO41: R37.1 U1.76(GPIO41/EPWM7B/SCI_RXDB)
GPIO42: R40.1 U1.1(GPIO42/EPWM8A/~{TZ1}/COMP1OUT)
GPIO43: R41.1 U1.8(GPIO43/EPWM8B/~{TZ2}/COMP2OUT)
GPIO44: U1.56(GPIO44/MFSRA/SCIRXDB/EPWM7B)
GPIO50: U1.42(GPIO50/EQEP1A/MDXA/TZ1)
GPIO51: U1.48(GPIO51/EQEP1B/MDRA/TZ2)
GPIO52: U1.53(GPIO52/EQEP1S/MCLKXA/TZ3)
GPIO53: U1.65(GPIO53/EQEP1I/MFSXA)
GPIO54: U1.69(GPIO54/SPISIMOA/EQEP2A/HRCAP1)
GPIO55: U1.75(GPIO55/SPISOMIA/EQEP2B/HRCAP2)
GPIO56: U1.85(GPIO56/SPICLKA/EQEP2I/HRCAP3)
GPIO57: U1.89(GPIO57/SPISTEA/EQEP2S/HRCAP4)
GPIO58: U1.94(GPIO58/MCLKRA/SCI_TXDB/EPWM7A)
NetD9_A: D9.A R38.1
NetD9_C: D9.C U9.6(1Y)
NetD10_A: D10.A R39.1
NetD10_C: D10.C U9.4(2Y)

### Notes on the sheet
- PWM
- UART
- COMPANY:
- Roy Yaung
- Drawn
- Checked
- Approved
- TITLE:
- Embest
- LAUNCHXL-F28069_B_1400922
- REV:
- Date:
- Document Number:
- 2014/12/8 15:08:46
- F28069_B
- Scale: 1/1
- Sheet:
- 1.1
- 4

### Library data of the parts
C24 C33-C36 = C-USC0402: as C10 on sheet LAUNCHXL-F28069_B_1400922_1; DeviceName: C0402; LibraryName: rcl; DeviceSetName: C-US
D9 D10 = LEDCHIP-LED0603: as D4 on sheet LAUNCHXL-F28069_B_1400922_1; SymbolName_1: LED; DeviceName: CHIP-LED0603; LibraryName: led; DeviceSetName: LED
R36-R41 = R-US_R0402: as R12 on sheet LAUNCHXL-F28069_B_1400922_1; DeviceName: R0402; LibraryName: rcl
TP5-TP8 = TESTPAD_TPB1,27: as TP10 on sheet LAUNCHXL-F28069_B_1400922_1; SymbolName_1: TESTPAD_TP; LibraryName: RF430FRL152H_EVM_a; DeviceSetName: TESTPAD_TP
U1 = TMS320F28069PZSR: as U1 on sheet LAUNCHXL-F28069_B_1400922_2; LibraryName: LAUNCHXL-F28027; DeviceSetName: TMS320F28069PZS
U9 = SN74LVC2G07: GateName_1: G$1; SymbolName_1: SN74LVC2G07; LibraryName: texas; DeviceSetName: SN74LVC2G07

## Sheet LAUNCHXL-F28069_B_1400922_4.SchDoc: LAUNCHXL-F28069_B_1400922
size 301 x 234 mm; Origin: Eagle; Date: 2014/12/8 15:08:46; SheetNumber: 5; GateName_1: G$1; SymbolName_1: FRAME_A_L; LibraryName: frames; DeviceSetName: FRAME_A_L; GateName_2: G$2; SymbolName_2: DOCFIELD; Sheet: Sheet:; REV: REV:; COMPANY: COMPANY:; Scale:1/1: Scale: 1/1; Drawn: Drawn; Checked: Checked; Approved: Approved; Embest: Embest
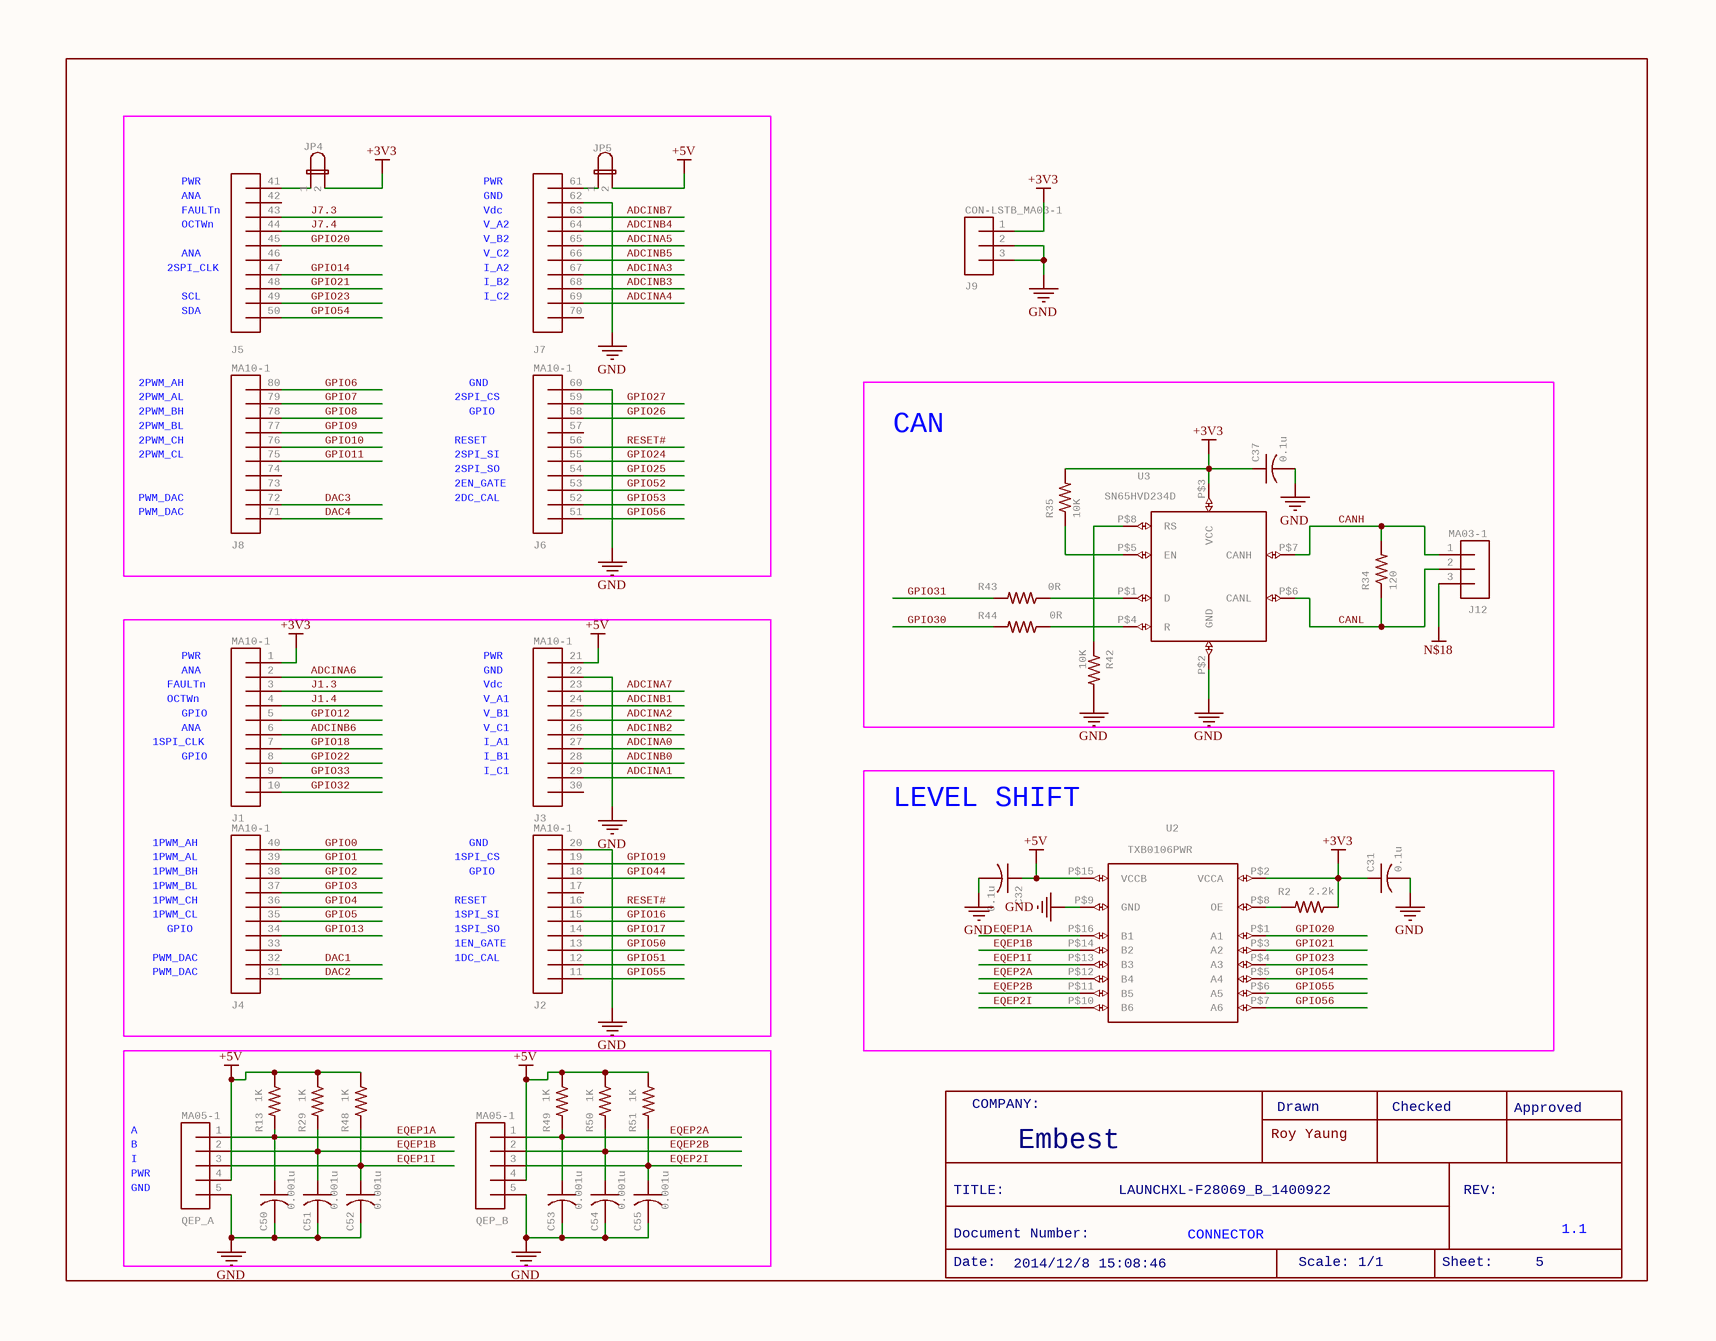
[diagram p4: LAUNCHXL-F28069_B_1400922_4.SchDoc]

### Parts
C31  0.1u  [C0402]
C32  0.1u  [C0402]
C37  0.1u  [C0402]
C50  0.001u  [C0402]
C51  0.001u  [C0402]
C52  0.001u  [C0402]
C53  0.001u  [C0402]
C54  0.001u  [C0402]
C55  0.001u  [C0402]
J1  MA10-1  [MA10-1]
J2  MA10-1  [MA10-1]
J3  MA10-1  [MA10-1]
J4  MA10-1  [MA10-1]
J5  MA10-1  [MA10-1]  (value not drawn)
J6  MA10-1  [MA10-1]
J7  MA10-1  [MA10-1]  (value not drawn)
J8  MA10-1  [MA10-1]
J9  CON-LSTB_MA03-1  [CON-LSTB_MA03-1]
J12  MA03-1  [MA03-1]
JP4  JP1ENORM  [JP1]  (value not drawn)
JP5  JP1ENORM  [JP1]  (value not drawn)
QEP_A  MA05-1  [MA05-1]
QEP_B  MA05-1  [MA05-1]
R2  2.2k  [R0402]
R13  1K  [R0402]
R29  1K  [R0402]
R34  120  [R0402]
R35  10K  [R0402]
R42  10K  [R0402]
R43  0R  [R0402]
R44  0R  [R0402]
R48  1K  [R0402]
R49  1K  [R0402]
R50  1K  [R0402]
R51  1K  [R0402]
U2  TXB0106PWR  [TSSOP16-PW]
U3  SN65HVD234D  [SOIC8-PDSO]
U$12  ROY_JUMPER  [ROY_JUMPER]  (value not drawn)
U$13  ROY_JUMPER  [ROY_JUMPER]  (value not drawn)

### Blocks framed on the sheet
CAN: C37 J12 R34 R35 R42-R44 U3
LEVEL SHIFT: C31 C32 R2 U2

### Nets
+3V3: C31.1 C37.1 J1.1 J9.1 JP4.2 R2.1 R35.2 U2.P$2(VCCA) U3.P$3(VCC)
EQEP1A: C32.1 C50.1 C51.1 C52.1 C53.1 C54.1 C55.1 J3.1 JP5.2 QEP_A.1 QEP_A.2 QEP_A.3 QEP_A.4 QEP_B.1 QEP_B.2 QEP_B.3 QEP_B.4 R13.1 R13.2 R29.1 R29.2 R48.1 R48.2 R49.1 R49.2 R50.1 R50.2 R51.1 R51.2 U2.P$10(B6) U2.P$11(B5) U2.P$12(B4) U2.P$13(B3) U2.P$14(B2) U2.P$15(VCCB) U2.P$16(B1)  [also labelled +5V, EQEP1B, EQEP1I, EQEP2A, EQEP2B, EQEP2I]
GND: C31.2 C32.2 C37.2 C50.2 C51.2 C52.2 C53.2 C54.2 C55.2 J2.1 J3.2 J6.1 J7.2 J9.2 J9.3 QEP_A.5 QEP_B.5 R42.2 U2.P$9(GND) U3.P$2(GND)
N$18: J12.3
ADCINA0: J3.7
ADCINA1: J3.9
ADCINA2: J3.5
ADCINA3: J7.7
ADCINA4: J7.9
ADCINA5: J7.5
ADCINA6: J1.2
ADCINA7: J3.3
ADCINB0: J3.8
ADCINB1: J3.4
ADCINB2: J3.6
ADCINB3: J7.8
ADCINB4: J7.4
ADCINB5: J7.6
ADCINB6: J1.6
ADCINB7: J7.3
CANH: J12.1 R34.2 U3.P$7(CANH)
CANL: J12.2 R34.1 U3.P$6(CANL)
DAC1: J4.9
DAC2: J4.10
DAC3: J8.9
DAC4: J8.10
GPIO0: J4.1
GPIO1: J4.2
GPIO2: J4.3
GPIO3: J4.4
GPIO4: J4.5
GPIO5: J4.6
GPIO6: J8.1
GPIO7: J8.2
GPIO8: J8.3
GPIO9: J8.4
GPIO10: J8.5
GPIO11: J8.6
GPIO12: J1.5
GPIO13: J4.7
GPIO14: J5.7
GPIO16: J2.6
GPIO17: J2.7
GPIO18: J1.7
GPIO19: J2.2
GPIO20: J5.5 U2.P$1(A1)
GPIO21: J5.8 U2.P$3(A2)
GPIO22: J1.8
GPIO23: J5.9 U2.P$4(A3)
GPIO24: J6.6
GPIO25: J6.7
GPIO26: J6.3
GPIO27: J6.2
GPIO30: R44.2
GPIO31: R43.2
GPIO32: J1.10
GPIO33: J1.9
GPIO44: J2.3
GPIO50: J2.8
GPIO51: J2.9
GPIO52: J6.8
GPIO53: J6.9
GPIO54: J5.10 U2.P$5(A4)
GPIO55: J2.10 U2.P$6(A5)
GPIO56: J6.10 U2.P$7(A6)
J1.3: J1.3
J1.4: J1.4
J7.3: J5.3
J7.4: J5.4
RESET#: J2.5 J6.5
NetJ5_1: J5.1 JP4.1
NetJ7_1: J7.1 JP5.1
NetR2_2: R2.2 U2.P$8(OE)
NetR35_1: R35.1 U3.P$5(EN)
NetR42_1: R42.1 U3.P$8(RS)
NetR43_1: R43.1 U3.P$1(D)
NetR44_1: R44.1 U3.P$4(R)

Not connected (* = marked no-connect by the designer): J2 4; J3 10; J4 8; J5 2 6; J6 4; J7 10; J8 7 8

### Notes on the sheet
- (near J5) PWR
- (near J5) ANA
- (near J5) FAULTn
- (near J5) 41
- (near J5) 42
- (near J5) 43
- (near J7) PWR
- (near J7) GND
- (near J7) Vdc
- 61
- 62
- (near J7) 63
- (near J5) 2SPI_CLK
- (near J5) OCTWn
- (near J5) 44
- (near J5) 45
- (near J5) 46
- (near J5) 47
- (near J5) 48
- (near J7) V_A2
- (near J7) V_B2
- (near J7) V_C2
- (near J7) I_A2
- (near J7) I_B2
- (near J7) 64
- (near J7) 65
- (near J7) 66
- (near J7) 67
- (near J7) 68
- (near J5) SCL
- (near J5) SDA
- (near J5) 49
- (near J5) 50
- (near J7) I_C2
- (near J7) 69
- (near J7) 70
- 2PWM_AH
- 2PWM_AL
- 2PWM_BH
- 2PWM_BL
- (near J8) 77
- (near J8) 78
- (near J8) 79
- (near J8) 80
- 2SPI_CS
- GND
- GPIO
- (near J6) 57
- (near J6) 58
- (near J6) 59
- (near J6) 60
- 2PWM_CH
- 2PWM_CL
- PWM_DAC
- (near J8) 72
- (near J8) 73
- (near J8) 74
- (near J8) 75
- (near J8) 76
- RESET
- 2SPI_SI
- 2SPI_SO
- 2EN_GATE
- 2DC_CAL
- (near J6) 52
- (near J6) 53
- (near J6) 54
- (near J6) 55
- (near J6) 56
- (near J8) 71
- (near J6) 51
- (near J1) FAULTn
- OCTWn
- (near J1) PWR
- (near J1) ANA
- (near J1) GPIO
- (near J1) 1
- (near J1) 2
- (near J1) 3
- (near J1) 4
- (near J1) 5
- (near J3) Vdc
- (near J3) V_A1
- (near J3) V_B1
- (near J3) PWR
- (near J3) GND
- (near J3) 21
- (near J3) 22
- (near J3) 23
- (near J3) 24
- (near J3) 25
- 1SPI_CLK
- (near J1) 6
- (near J1) 7
- (near J1) 8
- (near J1) 9
- (near J1) 10
- (near J3) V_C1
- (near J3) I_A1
- (near J3) I_B1
- (near J3) I_C1
- (near J3) 26
- (near J3) 27
- (near J3) 28
- (near J3) 29
- (near J3) 30
- 1PWM_AH
- 1PWM_AL
- (near J4) 39
- (near J4) 40
- 1SPI_CS
- (near J2) 19
- (near J2) 20
- 1PWM_BH
- 1PWM_BL
- 1PWM_CH
- 1PWM_CL
- (near J4) 34
- (near J4) 35
- (near J4) 36
- (near J4) 37
- (near J4) 38
- 1SPI_SI
- 1SPI_SO
- (near J2) 14
- (near J2) 15
- (near J2) 16
- (near J2) 17
- (near J2) 18
- (near J4) 31
- (near J4) 32
- (near J4) 33
- 1EN_GATE
- 1DC_CAL
- (near J2) 11
- (near J2) 12
- (near J2) 13
- A
- B
- COMPANY:
- Roy Yaung
- Drawn
- Checked
- Approved
- I
- (near QEP_A) GND
- (near QEP_A) PWR
- TITLE:
- Embest
- LAUNCHXL-F28069_B_1400922
- REV:
- Date:
- Document Number:
- 2014/12/8 15:08:46
- CONNECTOR
- Scale: 1/1
- Sheet:
- 5
- 1.1

### Library data of the parts
C31 C32 C37 C50-C55 = C-USC0402: as C10 on sheet LAUNCHXL-F28069_B_1400922_1; DeviceName: C0402; LibraryName: rcl; DeviceSetName: C-US
J1-J8 = MA10-1: PIN HEADER; GateName_1: 1; SymbolName_1: MA10-1; LibraryName: con-lstb; DeviceSetName: MA10-1; MF: MF; MPN: MPN; OC_FARNELL: unknown; OC_NEWARK: unknown
J9 = CON-LSTB_MA03-1: PIN HEADER; GateName_1: G$1; SymbolName_1: CON-LSTB_MA03-1; LibraryName: LAUNCHXL-F28027; DeviceSetName: CON-LSTB_MA03-1; MF: MF; MPN: MPN; OC_FARNELL: unknown; OC_NEWARK: unknown
J12 = MA03-1: PIN HEADER; GateName_1: G$1; SymbolName_1: MA03-1; LibraryName: con-lstb; DeviceSetName: MA03-1; MF: MF; MPN: MPN; OC_FARNELL: unknown; OC_NEWARK: unknown
JP4 JP5 = JP1ENORM: as JP1 on sheet LAUNCHXL-F28069_B_1400922_1; LibraryName: jumper
QEP_A QEP_B = MA05-1: PIN HEADER; GateName_1: G$1; SymbolName_1: MA05-1; LibraryName: con-lstb; DeviceSetName: MA05-1; MF: MF; MPN: MPN; OC_FARNELL: unknown; OC_NEWARK: unknown
R2 R13 R29 R34 R35 R42-R44 R48-R51 = R-US_R0402: as R12 on sheet LAUNCHXL-F28069_B_1400922_1; DeviceName: R0402; LibraryName: rcl
U2 = TXB0106PWR: GateName_1: G$1; SymbolName_1: TXB0106; LibraryName: LAUNCHXL-F28027; DeviceSetName: TXB0106PWR
U3 = SN65HVD234D: GateName_1: G$1; SymbolName_1: SN65HVD234; LibraryName: LAUNCHXL-F28027; DeviceSetName: SN65HVD234D
U$12 U$13 = ROY_JUMPER: GateName_1: G$1; SymbolName_1: ROY_JUMPER; LibraryName: roy; DeviceSetName: ROY_JUMPER

## Sheet LAUNCHXL-F28069_B_1400922_5.SchDoc: LAUNCHXL-F28069_B_1400922
size 301 x 234 mm; Origin: Eagle; Date: 2014/12/8 15:08:46; SheetNumber: 6; GateName_1: G$1; SymbolName_1: FRAME_A_L; LibraryName: frames; DeviceSetName: FRAME_A_L; GateName_2: G$2; SymbolName_2: DOCFIELD; Sheet: Sheet:; REV: REV:; COMPANY: COMPANY:; Scale:1/1: Scale: 1/1; Drawn: Drawn; Checked: Checked; Approved: Approved; Embest: Embest
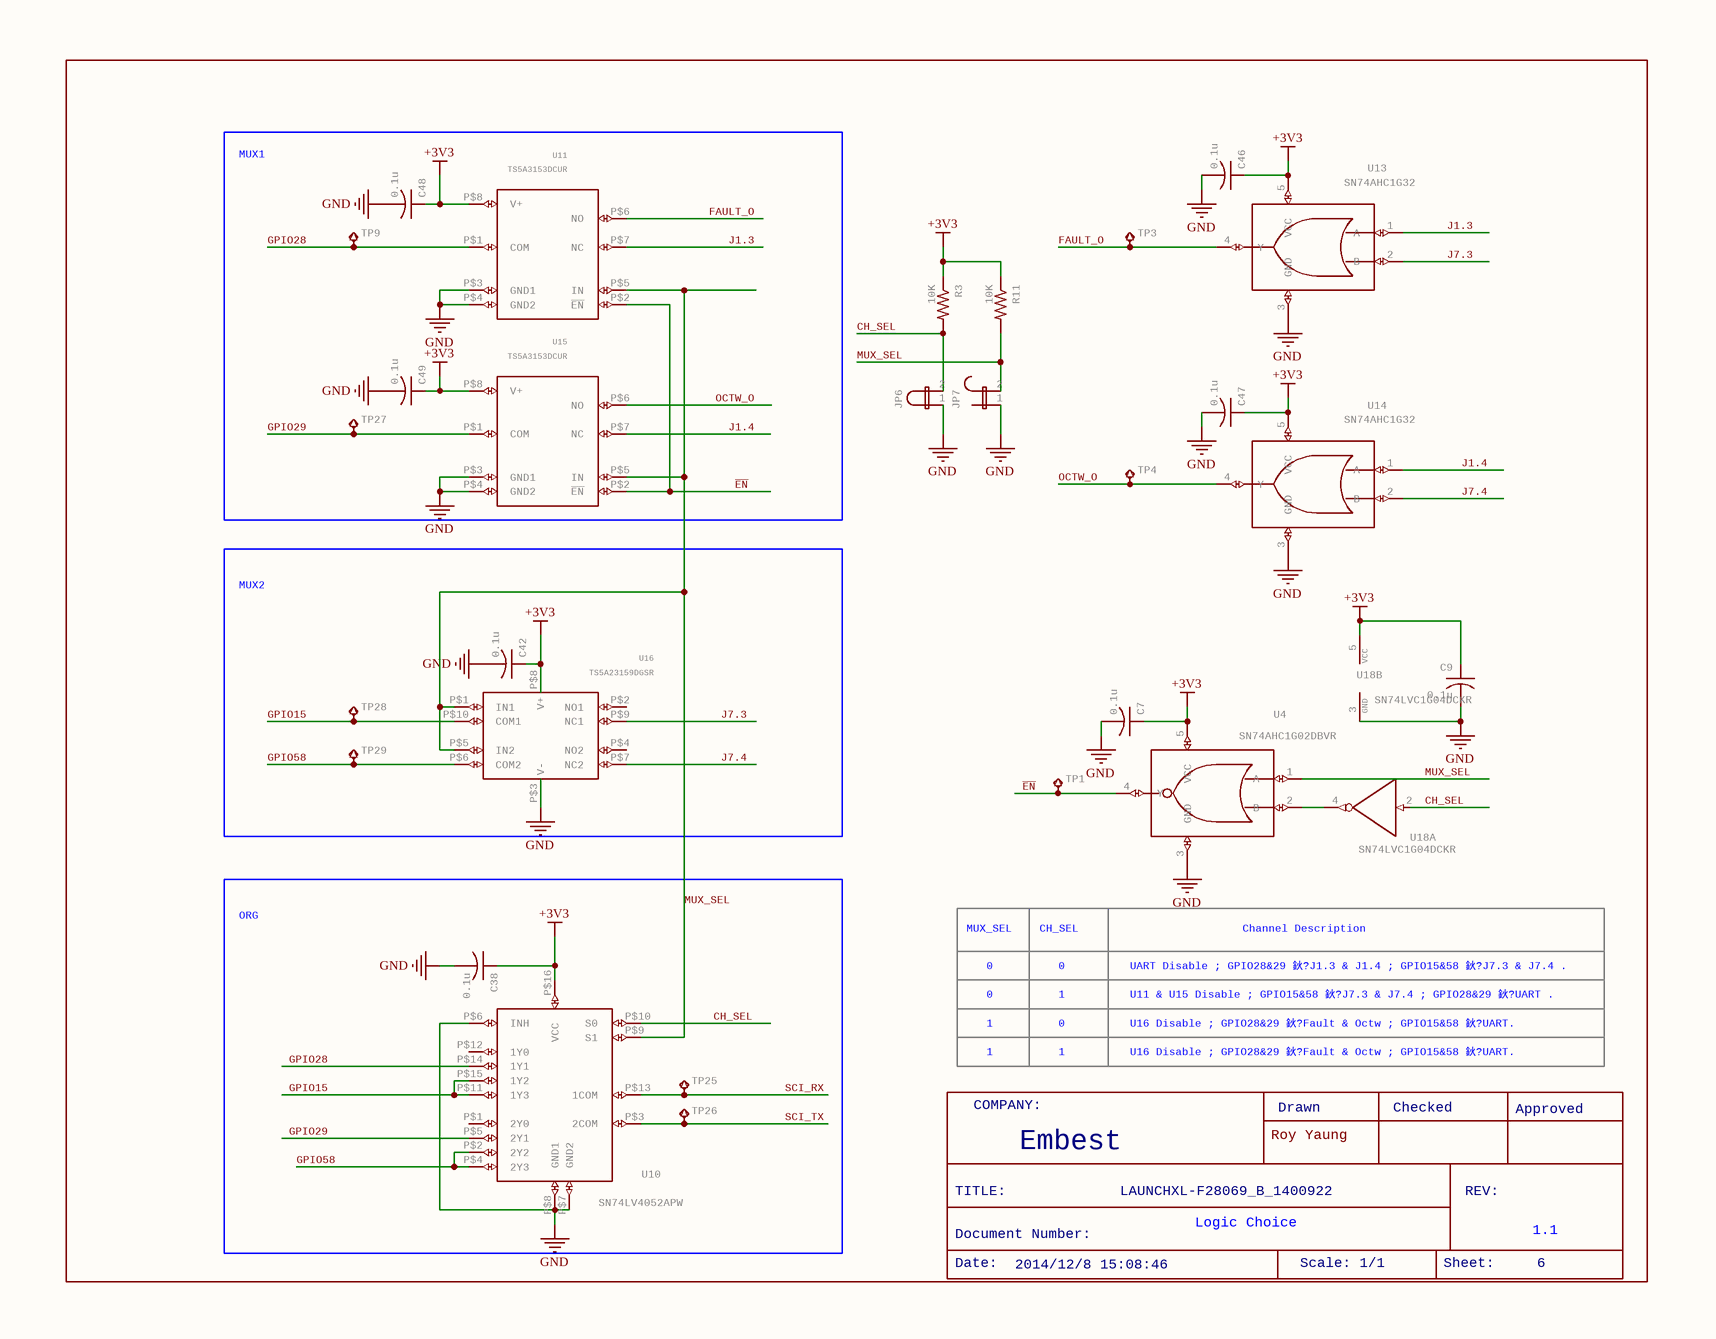
[diagram p5: LAUNCHXL-F28069_B_1400922_5.SchDoc]

### Parts
C7  0.1u  [C0402]
C9  0.1u  [C0402]
C38  0.1u  [C0402]
C42  0.1u  [C0402]
C46  0.1u  [C0402]
C47  0.1u  [C0402]
C48  0.1u  [C0402]
C49  0.1u  [C0402]
JP6  JP1ENORM  [JP1]  (value not drawn)
JP7  JP1ENORM  [JP1]  (value not drawn)
R3  10K  [R0402]
R11  10K  [R0402]
TP1  TESTPAD_TPB1,27  [TESTPAD_B1,27]  (value not drawn)
TP3  TESTPAD_TPB1,27  [TESTPAD_B1,27]  (value not drawn)
TP4  TESTPAD_TPB1,27  [TESTPAD_B1,27]  (value not drawn)
TP9  TESTPAD_TPB1,27  [TESTPAD_B1,27]  (value not drawn)
TP25  TESTPAD_TPB1,27  [TESTPAD_B1,27]  (value not drawn)
TP26  TESTPAD_TPB1,27  [TESTPAD_B1,27]  (value not drawn)
TP27  TESTPAD_TPB1,27  [TESTPAD_B1,27]  (value not drawn)
TP28  TESTPAD_TPB1,27  [TESTPAD_B1,27]  (value not drawn)
TP29  TESTPAD_TPB1,27  [TESTPAD_B1,27]  (value not drawn)
U4  SN74AHC1G02DBVR  [SOT23-5-DBV]
U10  SN74LV4052APW  [TSSOP16-PW]
U11  TS5A3153DCUR  [TI-DCU8]
U13  SN74AHC1G32  [SOT23-5-DBV]
U14  SN74AHC1G32  [SOT23-5-DBV]
U15  TS5A3153DCUR  [TI-DCU8]
U16  TS5A23159DGSR  [TI-DGS10]
U18  SN74LVC1G04DCKR  [74XX-LITTLE-DE_SC70-5]  (parts A,B of 2)
U$1  ROY_JUMPER  [ROY_JUMPER]  (value not drawn)
U$2  ROY_JUMPER  [ROY_JUMPER]  (value not drawn)

### Blocks framed on the sheet
MUX1: C48 C49 TP9 TP27 U11 U15
MUX2: C42 TP28 TP29 U16
ORG: C38 TP25 TP26 U10

### Nets
+3V3: C7.1 C9.1 C38.1 C42.1 C46.1 C47.1 C48.1 C49.1 R3.1 R11.1 U4.5(VCC) U10.P$16(VCC) U11.P$8(V+) U13.5(VCC) U14.5(VCC) U15.P$8(V+) U16.P$8(V+) U18.5(VCC)
GND: C7.2 C9.2 C38.2 C42.2 C46.2 C47.2 C48.2 C49.2 JP6.1 JP7.1 U4.3(GND) U10.P$6(INH) U10.P$7(GND2) U10.P$8(GND1) U11.P$3(GND1) U11.P$4(GND2) U13.3(GND) U14.3(GND) U15.P$3(GND1) U15.P$4(GND2) U16.P$3(V-) U18.3(GND)
CH_SEL: JP6.2 R3.2 U10.P$10(S0) U18.2(I)
~{EN}: TP1.TP U4.4(Y) U11.P$2(~{EN}) U15.P$2(~{EN})
FAULT_O: TP3.TP U11.P$6(NO) U13.4(Y)
GPIO15: TP28.TP U10.P$11(1Y3) U10.P$15(1Y2) U16.P$10(COM1)
GPIO28: TP9.TP U10.P$14(1Y1) U11.P$1(COM)
GPIO29: TP27.TP U10.P$5(2Y1) U15.P$1(COM)
GPIO58: TP29.TP U10.P$2(2Y2) U10.P$4(2Y3) U16.P$6(COM2)
J1.3: U11.P$7(NC) U13.1(A)
J1.4: U14.1(A) U15.P$7(NC)
J7.3: U13.2(B) U16.P$9(NC1)
J7.4: U14.2(B) U16.P$7(NC2)
MUX_SEL: JP7.2 R11.2 U4.1(A) U10.P$9(S1) U11.P$5(IN) U15.P$5(IN) U16.P$1(IN1) U16.P$5(IN2)
OCTW_O: TP4.TP U14.4(Y) U15.P$6(NO)
SCI_RX: TP25.TP U10.P$13(1COM)
SCI_TX: TP26.TP U10.P$3(2COM)
NetU4_2: U4.2(B) U18.4(O)

Not connected (* = marked no-connect by the designer): U10 P$1(2Y0) P$12(1Y0); U16 P$2(NO1) P$4(NO2)

### Notes on the sheet
- MUX_SEL
- CH_SEL
- Channel Description
- 0
- 1
- UART Disable ; GPIO28&29 鈥?J1.3 & J1.4 ; GPIO15&58 鈥?J7.3 & J7.4 .
- U11 & U15 Disable ; GPIO15&58 鈥?J7.3 & J7.4 ; GPIO28&29 鈥?UART .
- U16 Disable ; GPIO28&29 鈥?Fault & Octw ; GPIO15&58 鈥?UART.
- COMPANY:
- Roy Yaung
- Drawn
- Checked
- Approved
- TITLE:
- Embest
- LAUNCHXL-F28069_B_1400922
- REV:
- Date:
- Document Number:
- 2014/12/8 15:08:46
- Logic Choice
- Scale: 1/1
- Sheet:
- 1.1
- 6

### Library data of the parts
C7 C9 C38 C42 C46-C49 = C-USC0402: as C10 on sheet LAUNCHXL-F28069_B_1400922_1; DeviceName: C0402; LibraryName: rcl; DeviceSetName: C-US
JP6 JP7 = JP1ENORM: as JP1 on sheet LAUNCHXL-F28069_B_1400922_1; LibraryName: jumper
R3 R11 = R-US_R0402: as R12 on sheet LAUNCHXL-F28069_B_1400922_1; DeviceName: R0402; LibraryName: rcl
TP1 TP3 TP4 TP9 TP25-TP29 = TESTPAD_TPB1,27: as TP10 on sheet LAUNCHXL-F28069_B_1400922_1; SymbolName_1: TESTPAD_TP; LibraryName: RF430FRL152H_EVM_a; DeviceSetName: TESTPAD_TP
U4 = SN74AHC1G02: GateName_1: G$1; SymbolName_1: 74HC1G02A; LibraryName: LAUNCHXL-F28027; DeviceSetName: SN74AHC1G02
U10 = SN74LV4052APW: GateName_1: G$1; SymbolName_1: 74LV4052; LibraryName: LAUNCHXL-F28027; DeviceSetName: SN74LV4052APW
U11 U15 = TS5A3153DCUR: GateName_1: G$1; SymbolName_1: TS5A3153; LibraryName: LAUNCHXL-F28027; DeviceSetName: TS5A3153DCUR
U13 U14 = SN74AHC1G32: GateName_1: G$1; SymbolName_1: 74HC1G32A; LibraryName: LAUNCHXL-F28027; DeviceSetName: SN74AHC1G32
U16 = TS5A23159DGSR: GateName_1: G$1; SymbolName_1: TS5A23159; LibraryName: LAUNCHXL-F28027; DeviceSetName: TS5A23159DGSR
U18 = 74XX-LITTLE-DE_74*1G04DCK: INVERTER Gate; GateName_1: A; SymbolName_1: 74XX-LITTLE-DE_7404; GateName_2: P; SymbolName_2: 74XX-LITTLE-DE_PWRN; DeviceName: DCK; LibraryName: RF430FRL152H_EVM_a; DeviceSetName: 74XX-LITTLE-DE_74*1G04
U$1 U$2 = ROY_JUMPER: GateName_1: G$1; SymbolName_1: ROY_JUMPER; LibraryName: roy; DeviceSetName: ROY_JUMPER

## Sheet LAUNCHXL-F28069_B_1400922_6.SchDoc: LAUNCHXL-F28069_B_1400922
size 301 x 234 mm; Origin: Eagle; Date: 2014/12/8 15:08:46; SheetNumber: 7; GateName_1: G$1; SymbolName_1: FRAME_A_L; LibraryName: frames; DeviceSetName: FRAME_A_L; GateName_2: G$2; SymbolName_2: DOCFIELD; Sheet: Sheet:; REV: REV:; COMPANY: COMPANY:; Scale:1/1: Scale: 1/1; Drawn: Drawn; Checked: Checked; Approved: Approved; Embest: Embest
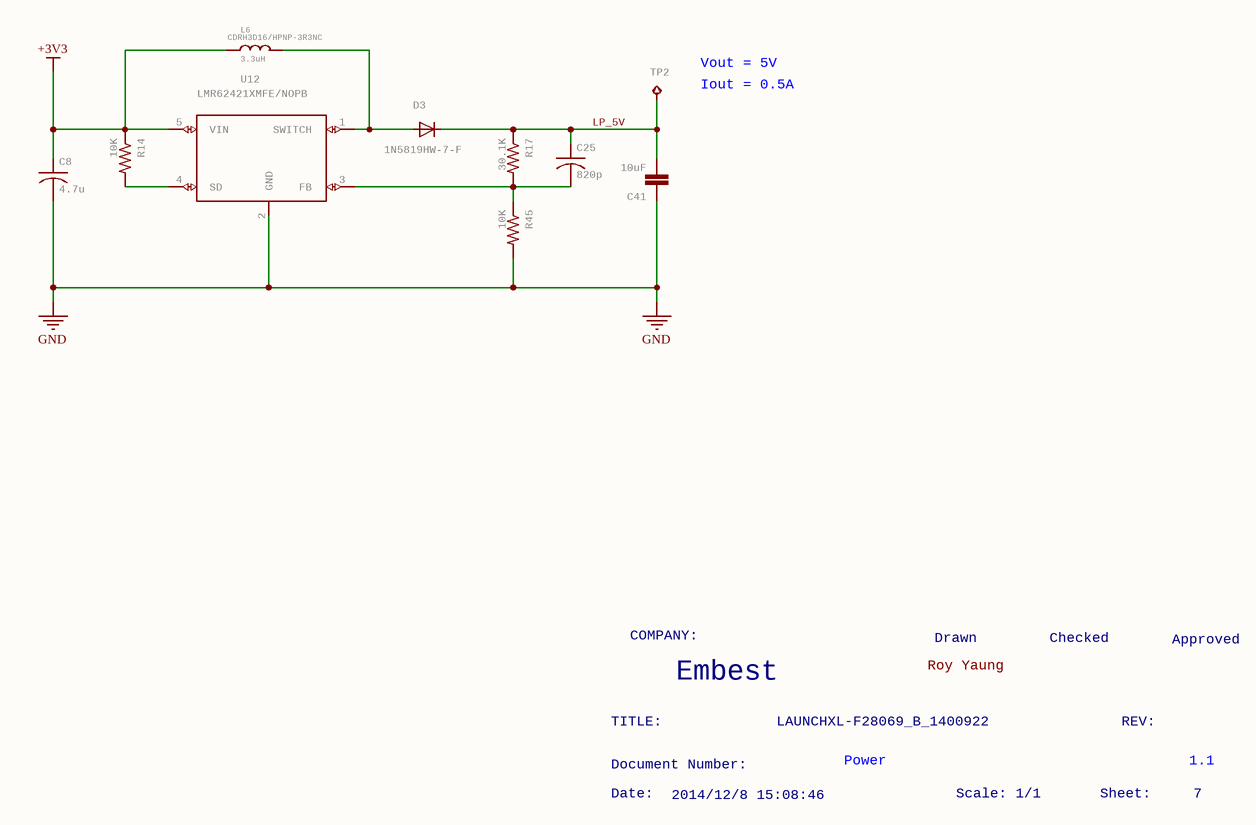
[diagram p6: LAUNCHXL-F28069_B_1400922_6.SchDoc]

### Parts
C8  4.7u  [C0402]
C25  820p  [C0402]
C41  10uF  [SPARKFUN_1210]
D3  1N5819HW-7-F  [SOD123]
L6  3.3uH  [INDUCT-3_7*3_5]
R14  10K  [R0402]
R17  30.1K  [R0402]
R45  10K  [R0402]
TP2  TESTPAD_TPB1,27  [TESTPAD_B1,27]  (value not drawn)
U12  LMR62421XMFE/NOPB  [SOT23-5-DBV]

### Nets
+3V3: C8.1 L6.P$1 R14.1 U12.5(VIN)
GND: C8.2 C41.1 R45.2 U12.2(GND)
LP_5V: C25.1 C41.2 D3.C R17.1 TP2.TP
NetC25_2: C25.2 R17.2 R45.1 U12.3(FB)
NetD3_A: D3.A L6.P$2 U12.1(SWITCH)
NetR14_2: R14.2 U12.4(SD)

### Notes on the sheet
- (near L6) CDRH3D16/HPNP-3R3NC
- (near TP2) Vout = 5V
- (near TP2) Iout = 0.5A
- COMPANY:
- Roy Yaung
- Drawn
- Checked
- Approved
- TITLE:
- Embest
- LAUNCHXL-F28069_B_1400922
- REV:
- Date:
- Document Number:
- 2014/12/8 15:08:46
- Power
- Scale: 1/1
- Sheet:
- 1.1
- 7

### Library data of the parts
C8 C25 = C-USC0402: as C10 on sheet LAUNCHXL-F28069_B_1400922_1; DeviceName: C0402; LibraryName: rcl; DeviceSetName: C-US
C41 = SPARKFUN_CAP1210: as C44 on sheet LAUNCHXL-F28069_B_1400922_1; SymbolName_1: SPARKFUN_CAP; LibraryName: RF430FRL152H_EVM_a; DeviceSetName: SPARKFUN_CAP
D3 = 1N4148: DIODE   high speed (Philips); GateName_1: G$1; SymbolName_1: D; LibraryName: diode; DeviceSetName: 1N4148
L6 = VLF4012A: GateName_1: 1; SymbolName_1: INDUCTOR; LibraryName: LAUNCHXL-F28027; DeviceSetName: VLF4012A
R14 R17 R45 = R-US_R0402: as R12 on sheet LAUNCHXL-F28069_B_1400922_1; DeviceName: R0402; LibraryName: rcl
TP2 = TESTPAD_TPB1,27: as TP10 on sheet LAUNCHXL-F28069_B_1400922_1; SymbolName_1: TESTPAD_TP; LibraryName: RF430FRL152H_EVM_a; DeviceSetName: TESTPAD_TP
U12 = LMR62421XMFE/NOPB: GateName_1: G$1; SymbolName_1: LMR62421; LibraryName: LAUNCHXL-F28027; DeviceSetName: LMR62421XMFE/NOPB

## Nets that join several sheets
+3V3: LAUNCHXL-F28069_B_1400922_1 (8 pins), LAUNCHXL-F28069_B_1400922_2 (9 pins), LAUNCHXL-F28069_B_1400922_3 (C24.1 R38.2 R39.2 U9.5), LAUNCHXL-F28069_B_1400922_4 (9 pins), LAUNCHXL-F28069_B_1400922_5 (18 pins), LAUNCHXL-F28069_B_1400922_6 (C8.1 L6.P$1 R14.1 U12.5)
EQEP1A: LAUNCHXL-F28069_B_1400922_1 (JP3.2 TP10.TP), LAUNCHXL-F28069_B_1400922_4 (36 pins)
GND: LAUNCHXL-F28069_B_1400922_1 (6 pins), LAUNCHXL-F28069_B_1400922_2 (39 pins), LAUNCHXL-F28069_B_1400922_3 (6 pins), LAUNCHXL-F28069_B_1400922_4 (20 pins), LAUNCHXL-F28069_B_1400922_5 (22 pins), LAUNCHXL-F28069_B_1400922_6 (C8.2 C41.1 R45.2 U12.2)
ADCINA0: LAUNCHXL-F28069_B_1400922_2 (U1.23), LAUNCHXL-F28069_B_1400922_4 (J3.7)
ADCINA1: LAUNCHXL-F28069_B_1400922_2 (U1.22), LAUNCHXL-F28069_B_1400922_4 (J3.9)
ADCINA2: LAUNCHXL-F28069_B_1400922_2 (U1.21), LAUNCHXL-F28069_B_1400922_4 (J3.5)
ADCINA3: LAUNCHXL-F28069_B_1400922_2 (U1.20), LAUNCHXL-F28069_B_1400922_4 (J7.7)
ADCINA4: LAUNCHXL-F28069_B_1400922_2 (U1.19), LAUNCHXL-F28069_B_1400922_4 (J7.9)
ADCINA5: LAUNCHXL-F28069_B_1400922_2 (U1.18), LAUNCHXL-F28069_B_1400922_4 (J7.5)
ADCINA6: LAUNCHXL-F28069_B_1400922_2 (U1.17), LAUNCHXL-F28069_B_1400922_4 (J1.2)
ADCINA7: LAUNCHXL-F28069_B_1400922_2 (U1.16), LAUNCHXL-F28069_B_1400922_4 (J3.3)
ADCINB0: LAUNCHXL-F28069_B_1400922_2 (U1.28), LAUNCHXL-F28069_B_1400922_4 (J3.8)
ADCINB1: LAUNCHXL-F28069_B_1400922_2 (U1.29), LAUNCHXL-F28069_B_1400922_4 (J3.4)
ADCINB2: LAUNCHXL-F28069_B_1400922_2 (U1.30), LAUNCHXL-F28069_B_1400922_4 (J3.6)
ADCINB3: LAUNCHXL-F28069_B_1400922_2 (U1.31), LAUNCHXL-F28069_B_1400922_4 (J7.8)
ADCINB4: LAUNCHXL-F28069_B_1400922_2 (U1.32), LAUNCHXL-F28069_B_1400922_4 (J7.4)
ADCINB5: LAUNCHXL-F28069_B_1400922_2 (U1.33), LAUNCHXL-F28069_B_1400922_4 (J7.6)
ADCINB6: LAUNCHXL-F28069_B_1400922_2 (U1.34), LAUNCHXL-F28069_B_1400922_4 (J1.6)
ADCINB7: LAUNCHXL-F28069_B_1400922_2 (U1.35), LAUNCHXL-F28069_B_1400922_4 (J7.3)
DAC1: LAUNCHXL-F28069_B_1400922_3 (C36.1 R36.2 TP8.TP), LAUNCHXL-F28069_B_1400922_4 (J4.9)
DAC2: LAUNCHXL-F28069_B_1400922_3 (C33.1 R37.2 TP7.TP), LAUNCHXL-F28069_B_1400922_4 (J4.10)
DAC3: LAUNCHXL-F28069_B_1400922_3 (C34.1 R40.2 TP6.TP), LAUNCHXL-F28069_B_1400922_4 (J8.9)
DAC4: LAUNCHXL-F28069_B_1400922_3 (C35.1 R41.2 TP5.TP), LAUNCHXL-F28069_B_1400922_4 (J8.10)
GPIO0: LAUNCHXL-F28069_B_1400922_3 (U1.87), LAUNCHXL-F28069_B_1400922_4 (J4.1)
GPIO1: LAUNCHXL-F28069_B_1400922_3 (U1.86), LAUNCHXL-F28069_B_1400922_4 (J4.2)
GPIO2: LAUNCHXL-F28069_B_1400922_3 (U1.84), LAUNCHXL-F28069_B_1400922_4 (J4.3)
GPIO3: LAUNCHXL-F28069_B_1400922_3 (U1.83), LAUNCHXL-F28069_B_1400922_4 (J4.4)
GPIO4: LAUNCHXL-F28069_B_1400922_3 (U1.9), LAUNCHXL-F28069_B_1400922_4 (J4.5)
GPIO5: LAUNCHXL-F28069_B_1400922_3 (U1.10), LAUNCHXL-F28069_B_1400922_4 (J4.6)
GPIO6: LAUNCHXL-F28069_B_1400922_3 (U1.58), LAUNCHXL-F28069_B_1400922_4 (J8.1)
GPIO7: LAUNCHXL-F28069_B_1400922_3 (U1.57), LAUNCHXL-F28069_B_1400922_4 (J8.2)
GPIO8: LAUNCHXL-F28069_B_1400922_3 (U1.54), LAUNCHXL-F28069_B_1400922_4 (J8.3)
GPIO9: LAUNCHXL-F28069_B_1400922_3 (U1.49), LAUNCHXL-F28069_B_1400922_4 (J8.4)
GPIO10: LAUNCHXL-F28069_B_1400922_3 (U1.74), LAUNCHXL-F28069_B_1400922_4 (J8.5)
GPIO11: LAUNCHXL-F28069_B_1400922_3 (U1.73), LAUNCHXL-F28069_B_1400922_4 (J8.6)
GPIO12: LAUNCHXL-F28069_B_1400922_3 (U1.44), LAUNCHXL-F28069_B_1400922_4 (J1.5)
GPIO13: LAUNCHXL-F28069_B_1400922_3 (U1.95), LAUNCHXL-F28069_B_1400922_4 (J4.7)
GPIO14: LAUNCHXL-F28069_B_1400922_3 (U1.96), LAUNCHXL-F28069_B_1400922_4 (J5.7)
GPIO15: LAUNCHXL-F28069_B_1400922_3 (U1.88), LAUNCHXL-F28069_B_1400922_5 (TP28.TP U10.P$11 U10.P$15 U16.P$10)
GPIO16: LAUNCHXL-F28069_B_1400922_3 (U1.55), LAUNCHXL-F28069_B_1400922_4 (J2.6)
GPIO17: LAUNCHXL-F28069_B_1400922_3 (U1.52), LAUNCHXL-F28069_B_1400922_4 (J2.7)
GPIO18: LAUNCHXL-F28069_B_1400922_2 (U1.51), LAUNCHXL-F28069_B_1400922_4 (J1.7)
GPIO19: LAUNCHXL-F28069_B_1400922_2 (U1.64), LAUNCHXL-F28069_B_1400922_4 (J2.2)
GPIO20: LAUNCHXL-F28069_B_1400922_3 (U1.6), LAUNCHXL-F28069_B_1400922_4 (J5.5 U2.P$1)
GPIO21: LAUNCHXL-F28069_B_1400922_3 (U1.7), LAUNCHXL-F28069_B_1400922_4 (J5.8 U2.P$3)
GPIO22: LAUNCHXL-F28069_B_1400922_3 (U1.98), LAUNCHXL-F28069_B_1400922_4 (J1.8)
GPIO23: LAUNCHXL-F28069_B_1400922_3 (U1.2), LAUNCHXL-F28069_B_1400922_4 (J5.9 U2.P$4)
GPIO24: LAUNCHXL-F28069_B_1400922_3 (U1.97), LAUNCHXL-F28069_B_1400922_4 (J6.6)
GPIO25: LAUNCHXL-F28069_B_1400922_3 (U1.39), LAUNCHXL-F28069_B_1400922_4 (J6.7)
GPIO26: LAUNCHXL-F28069_B_1400922_3 (U1.78), LAUNCHXL-F28069_B_1400922_4 (J6.3)
GPIO27: LAUNCHXL-F28069_B_1400922_3 (U1.77), LAUNCHXL-F28069_B_1400922_4 (J6.2)
GPIO28: LAUNCHXL-F28069_B_1400922_3 (U1.50), LAUNCHXL-F28069_B_1400922_5 (TP9.TP U10.P$14 U11.P$1)
GPIO29: LAUNCHXL-F28069_B_1400922_3 (U1.43), LAUNCHXL-F28069_B_1400922_5 (TP27.TP U10.P$5 U15.P$1)
GPIO30: LAUNCHXL-F28069_B_1400922_3 (U1.41), LAUNCHXL-F28069_B_1400922_4 (R44.2)
GPIO31: LAUNCHXL-F28069_B_1400922_3 (U1.40), LAUNCHXL-F28069_B_1400922_4 (R43.2)
GPIO32: LAUNCHXL-F28069_B_1400922_3 (U1.99), LAUNCHXL-F28069_B_1400922_4 (J1.10)
GPIO33: LAUNCHXL-F28069_B_1400922_3 (U1.100), LAUNCHXL-F28069_B_1400922_4 (J1.9)
GPIO34: LAUNCHXL-F28069_B_1400922_2 (R8.2 S1.1), LAUNCHXL-F28069_B_1400922_3 (U1.68 U9.1)
GPIO44: LAUNCHXL-F28069_B_1400922_3 (U1.56), LAUNCHXL-F28069_B_1400922_4 (J2.3)
GPIO50: LAUNCHXL-F28069_B_1400922_3 (U1.42), LAUNCHXL-F28069_B_1400922_4 (J2.8)
GPIO51: LAUNCHXL-F28069_B_1400922_3 (U1.48), LAUNCHXL-F28069_B_1400922_4 (J2.9)
GPIO52: LAUNCHXL-F28069_B_1400922_3 (U1.53), LAUNCHXL-F28069_B_1400922_4 (J6.8)
GPIO53: LAUNCHXL-F28069_B_1400922_3 (U1.65), LAUNCHXL-F28069_B_1400922_4 (J6.9)
GPIO54: LAUNCHXL-F28069_B_1400922_3 (U1.69), LAUNCHXL-F28069_B_1400922_4 (J5.10 U2.P$5)
GPIO55: LAUNCHXL-F28069_B_1400922_3 (U1.75), LAUNCHXL-F28069_B_1400922_4 (J2.10 U2.P$6)
GPIO56: LAUNCHXL-F28069_B_1400922_3 (U1.85), LAUNCHXL-F28069_B_1400922_4 (J6.10 U2.P$7)
GPIO58: LAUNCHXL-F28069_B_1400922_3 (U1.94), LAUNCHXL-F28069_B_1400922_5 (TP29.TP U10.P$2 U10.P$4 U16.P$6)
J1.3: LAUNCHXL-F28069_B_1400922_4 (J1.3), LAUNCHXL-F28069_B_1400922_5 (U11.P$7 U13.1)
J1.4: LAUNCHXL-F28069_B_1400922_4 (J1.4), LAUNCHXL-F28069_B_1400922_5 (U14.1 U15.P$7)
J7.3: LAUNCHXL-F28069_B_1400922_4 (J5.3), LAUNCHXL-F28069_B_1400922_5 (U13.2 U16.P$9)
J7.4: LAUNCHXL-F28069_B_1400922_4 (J5.4), LAUNCHXL-F28069_B_1400922_5 (U14.2 U16.P$7)
JTAG_TRST: LAUNCHXL-F28069_B_1400922_1 (R28.2 U7.5), LAUNCHXL-F28069_B_1400922_2 (S1.4)
LP_5V: LAUNCHXL-F28069_B_1400922_1 (JP3.1), LAUNCHXL-F28069_B_1400922_6 (5 pins)
RESET#: LAUNCHXL-F28069_B_1400922_2 (6 pins), LAUNCHXL-F28069_B_1400922_4 (J2.5 J6.5)
SCI_RX: LAUNCHXL-F28069_B_1400922_1 (R16.2 U5.11), LAUNCHXL-F28069_B_1400922_5 (TP25.TP U10.P$13)
SCI_TX: LAUNCHXL-F28069_B_1400922_1 (R30.2 U7.4), LAUNCHXL-F28069_B_1400922_5 (TP26.TP U10.P$3)
TCK: LAUNCHXL-F28069_B_1400922_1 (R20.2 U5.14), LAUNCHXL-F28069_B_1400922_2 (U1.67)
TDI: LAUNCHXL-F28069_B_1400922_1 (R19.2 U5.13), LAUNCHXL-F28069_B_1400922_2 (U1.71)
TDO: LAUNCHXL-F28069_B_1400922_1 (R32.2 U7.3), LAUNCHXL-F28069_B_1400922_2 (R9.2 S1.2 U1.70)
TMS: LAUNCHXL-F28069_B_1400922_1 (R18.2 U5.12), LAUNCHXL-F28069_B_1400922_2 (U1.72)